# EAGLE design rpcm_board (EAGLE 8.4.2)

## Sheet 1 of 2
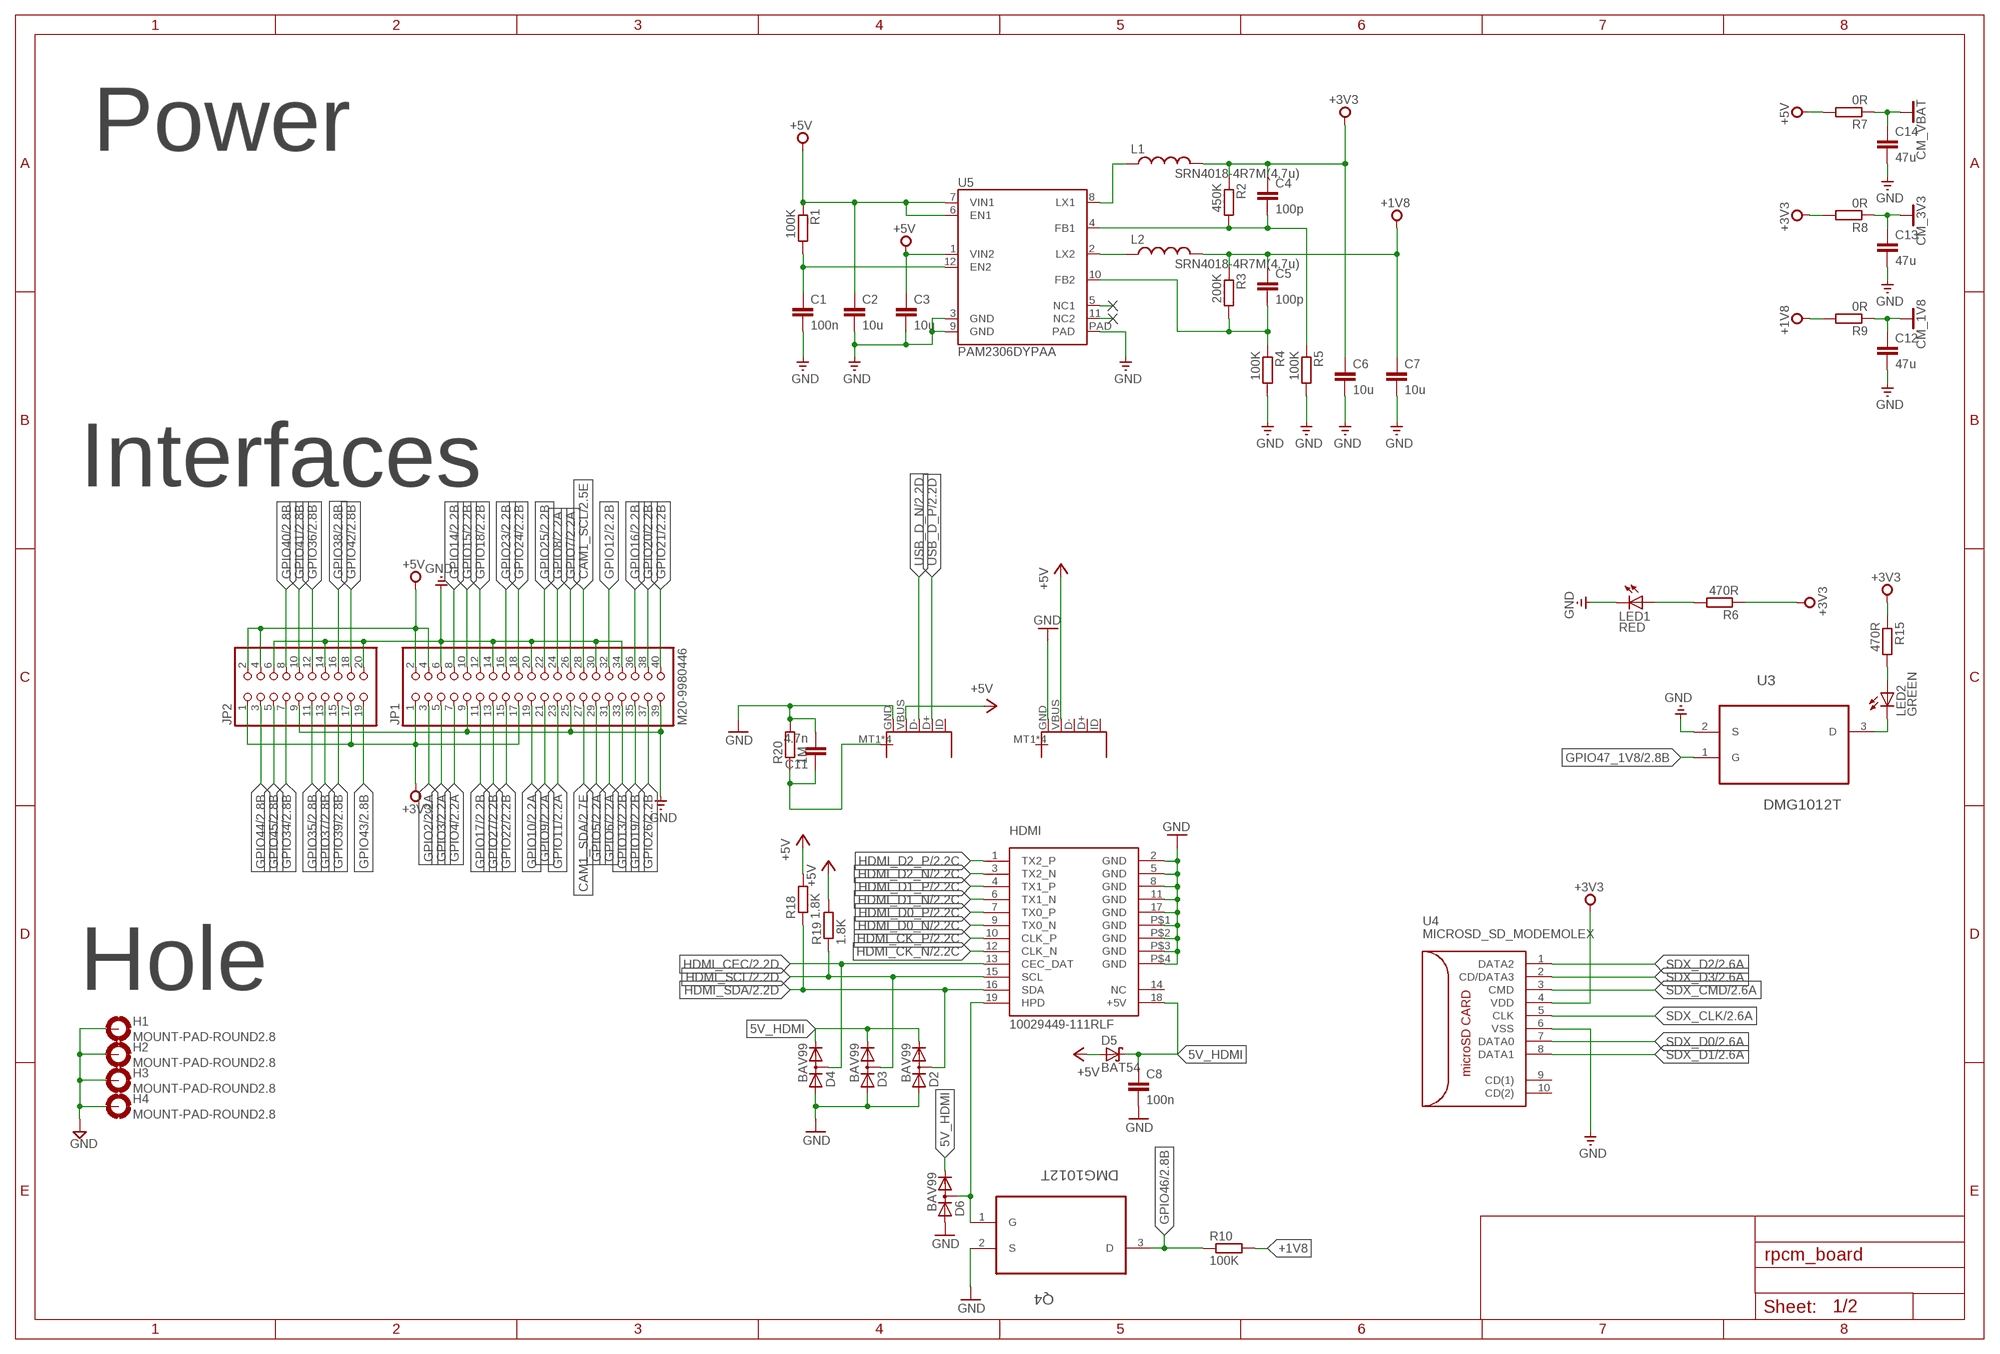
[diagram p0: schematic, sheet 1]

### Parts
C1  100n  C-EUC0402  [C0402]
C2  10u  C-EUC0805  [C0805]
C3  10u  C-EUC0805  [C0805]
C4  100p  C-EUC0402  [C0402]
C5  100p  C-EUC0402  [C0402]
C6  10u  C-EUC0805  [C0805]
C7  10u  C-EUC0805  [C0805]
C8  100n  C-EUC0402  [C0402]
C11  4.7n  C-EUC0402  [C0402]
C12  47u  C-EUC1206  [C1206]
C13  47u  C-EUC1206  [C1206]
C14  47u  C-EUC1206  [C1206]
D2  BAV99  BAV199  [SOT23]
D3  BAV99  BAV199  [SOT23]
D4  BAV99  BAV199  [SOT23]
D5  BAT54  [SOT23]
D6  BAV99  BAV199  [SOT23]
H1  MOUNT-PAD-ROUND2.8  [2,8-PAD]
H2  MOUNT-PAD-ROUND2.8  [2,8-PAD]
H3  MOUNT-PAD-ROUND2.8  [2,8-PAD]
H4  MOUNT-PAD-ROUND2.8  [2,8-PAD]
HDMI  10029449-111RLF  HDMI  [HDMI]
JP1  M20-9980446  PINHD-2X20  [2X20]
JP2  PINHD-2X10  [2X10]
JP3  USB-IDMICRO  [USB-MICRO]
JP6  USB-IDMICRO  [USB-MICRO]
L1  SRN4018-4R7M(4.7u)  BOURNS-SRN4018  [BOURNS-SRN4018]
L2  SRN4018-4R7M(4.7u)  BOURNS-SRN4018  [BOURNS-SRN4018]
LED1  RED  LEDCHIP-LED0603  [CHIP-LED0603]
LED2  GREEN  LEDCHIP-LED0603  [CHIP-LED0603]
Q4  DMG1012T  [SOT523]
R1  100K  R-EU_R0402  [R0402]
R2  450K  R-EU_R0402  [R0402]
R3  200K  R-EU_R0402  [R0402]
R4  100K  R-EU_R0402  [R0402]
R5  100K  R-EU_R0402  [R0402]
R6  470R  R-EU_R0402  [R0402]
R7  0R  R-EU_R0805  [R0805]
R8  0R  R-EU_R0805  [R0805]
R9  0R  R-EU_R0805  [R0805]
R10  100K  R-EU_R0402  [R0402]
R15  470R  R-EU_R0402  [R0402]
R18  1.8K  R-EU_R0402  [R0402]
R19  1.8K  R-EU_R0402  [R0402]
R20  1M  R-EU_R0402  [R0402]
U3  DMG1012T  [SOT523]
U4  MICROSD_SD_MODEMOLEX  [MOLEX_1040310811]
U5  PAM2306DYPAA  PAM2306  [WDFN3X3-12L]

### Nets
5V_HDMI: C8.1 D2.2(C) D3.2(C) D4.2(C) D5.3(C) D6.2(C) HDMI.18(+5V)
+1V8: C5.1 C7.1 L2.P$1 R3.1 R9.2 R10.2
+3V3: C4.1 C6.1 JP1.1 JP1.17 JP2.1 JP2.17 L1.P$1 R2.1 R6.1 R8.2 R15.1 U4.4(VDD) ; also sheet 2
+5V [VCC]: C2.1 C3.1 D5.1(A) JP1.2 JP1.4 JP2.2 JP2.4 JP3.VBUS JP6.VBUS R1.1 R7.2 R18.2 R19.2 U5.1(VIN2) U5.6(EN1) U5.7(VIN1)
CAM1_SCL: JP1.28 ; also sheet 2
CAM1_SDA: JP1.27 ; also sheet 2
CM_1V8: C12.1 R9.1 ; also sheet 2
CM_3V3: C13.1 R8.1 ; also sheet 2
CM_VBAT: C14.1 R7.1 ; also sheet 2
GND [GND]: C1.2 C2.2 C3.2 C6.2 C7.2 C8.2 C11.2 C12.2 C13.2 C14.2 D2.1(A) D3.1(A) D4.1(A) D6.1(A) H1.B2,8(MOUNT) H2.B2,8(MOUNT) H3.B2,8(MOUNT) H4.B2,8(MOUNT) HDMI.2(GND) HDMI.5(GND) HDMI.8(GND) HDMI.11(GND) HDMI.17(GND) HDMI.P$1(GND) HDMI.P$2(GND) HDMI.P$3(GND) HDMI.P$4(GND) JP1.6 JP1.9 JP1.14 JP1.20 JP1.25 JP1.30 JP1.34 JP1.39 JP2.6 JP2.9 JP2.14 JP2.20 JP3.GND JP6.GND LED1.C Q4.2(S) R4.2 R5.2 R20.2 U3.2(S) U4.6(VSS) U5.3(GND) U5.9(GND) U5.PAD ; also sheet 2
GPIO2: JP1.3 ; also sheet 2
GPIO3: JP1.5 ; also sheet 2
GPIO4: JP1.7 ; also sheet 2
GPIO5: JP1.29 ; also sheet 2
GPIO6: JP1.31 ; also sheet 2
GPIO7: JP1.26 ; also sheet 2
GPIO8: JP1.24 ; also sheet 2
GPIO9: JP1.21 ; also sheet 2
GPIO10: JP1.19 ; also sheet 2
GPIO11: JP1.23 ; also sheet 2
GPIO12: JP1.32 ; also sheet 2
GPIO13: JP1.33 ; also sheet 2
GPIO14: JP1.8 ; also sheet 2
GPIO15: JP1.10 ; also sheet 2
GPIO16: JP1.36 ; also sheet 2
GPIO17: JP1.11 ; also sheet 2
GPIO18: JP1.12 ; also sheet 2
GPIO19: JP1.35 ; also sheet 2
GPIO20: JP1.38 ; also sheet 2
GPIO21: JP1.40 ; also sheet 2
GPIO22: JP1.15 ; also sheet 2
GPIO23: JP1.16 ; also sheet 2
GPIO24: JP1.18 ; also sheet 2
GPIO25: JP1.22 ; also sheet 2
GPIO26: JP1.37 ; also sheet 2
GPIO27: JP1.13 ; also sheet 2
GPIO34: JP2.7 ; also sheet 2
GPIO35: JP2.11 ; also sheet 2
GPIO36: JP2.12 ; also sheet 2
GPIO37: JP2.13 ; also sheet 2
GPIO38: JP2.16 ; also sheet 2
GPIO39: JP2.15 ; also sheet 2
GPIO40: JP2.8 ; also sheet 2
GPIO41: JP2.10 ; also sheet 2
GPIO42: JP2.18 ; also sheet 2
GPIO43: JP2.19 ; also sheet 2
GPIO44: JP2.3 ; also sheet 2
GPIO45: JP2.5 ; also sheet 2
GPIO46: Q4.3(D) R10.1 ; also sheet 2
GPIO47_1V8: U3.1(G) ; also sheet 2
HDMI_CEC: D4.3(AC) HDMI.13(CEC_DAT) ; also sheet 2
HDMI_CK_N: HDMI.12(CLK_N) ; also sheet 2
HDMI_CK_P: HDMI.10(CLK_P) ; also sheet 2
HDMI_D0_N: HDMI.9(TX0_N) ; also sheet 2
HDMI_D0_P: HDMI.7(TX0_P) ; also sheet 2
HDMI_D1_N: HDMI.6(TX1_N) ; also sheet 2
HDMI_D1_P: HDMI.4(TX1_P) ; also sheet 2
HDMI_D2_N: HDMI.3(TX2_N) ; also sheet 2
HDMI_D2_P: HDMI.1(TX2_P) ; also sheet 2
HDMI_SCL: D3.3(AC) HDMI.15(SCL) R19.1 ; also sheet 2
HDMI_SDA: D2.3(AC) HDMI.16(SDA) R18.1 ; also sheet 2
N$1: C1.1 R1.2 U5.12(EN2)
N$2: L1.P$2 U5.8(LX1)
N$3: U5.5(NC1)
N$4: U5.11(NC2)
N$7: L2.P$2 U5.2(LX2)
N$8: C4.2 R2.2 R5.1 U5.4(FB1)
N$9: LED1.A R6.2
N$10: C5.2 R3.2 R4.1 U5.10(FB2)
N$32: LED2.A R15.2
N$33: LED2.C U3.3(D)
N$34: D6.3(AC) HDMI.19(HPD) Q4.1(G)
SDX_CLK: U4.5(CLK) ; also sheet 2
SDX_CMD: U4.3(CMD) ; also sheet 2
SDX_D0: U4.7(DATA0) ; also sheet 2
SDX_D1: U4.8(DATA1) ; also sheet 2
SDX_D2: U4.1(DATA2) ; also sheet 2
SDX_D3: U4.2(CD/DATA3) ; also sheet 2
USB2_SHELL [GND]: C11.1 JP6.MT1(SHELL) JP6.MT2(SHELL) JP6.P$1(SHELL) JP6.P$2(SHELL) R20.1
USB_D_N [90ohm_differencial_pair]: JP6.D- ; also sheet 2
USB_D_P [90ohm_differencial_pair]: JP6.D+ ; also sheet 2
Unconnected: HDMI.14(NC) JP3.D+ JP3.D- JP3.ID JP3.MT1(SHELL) JP3.MT2(SHELL) JP3.P$1(SHELL) JP3.P$2(SHELL) JP6.ID U4.9(CD(1)) U4.10(CD(2))

### Notes on the sheet
- Power
- Interfaces
- Hole

## Sheet 2 of 2
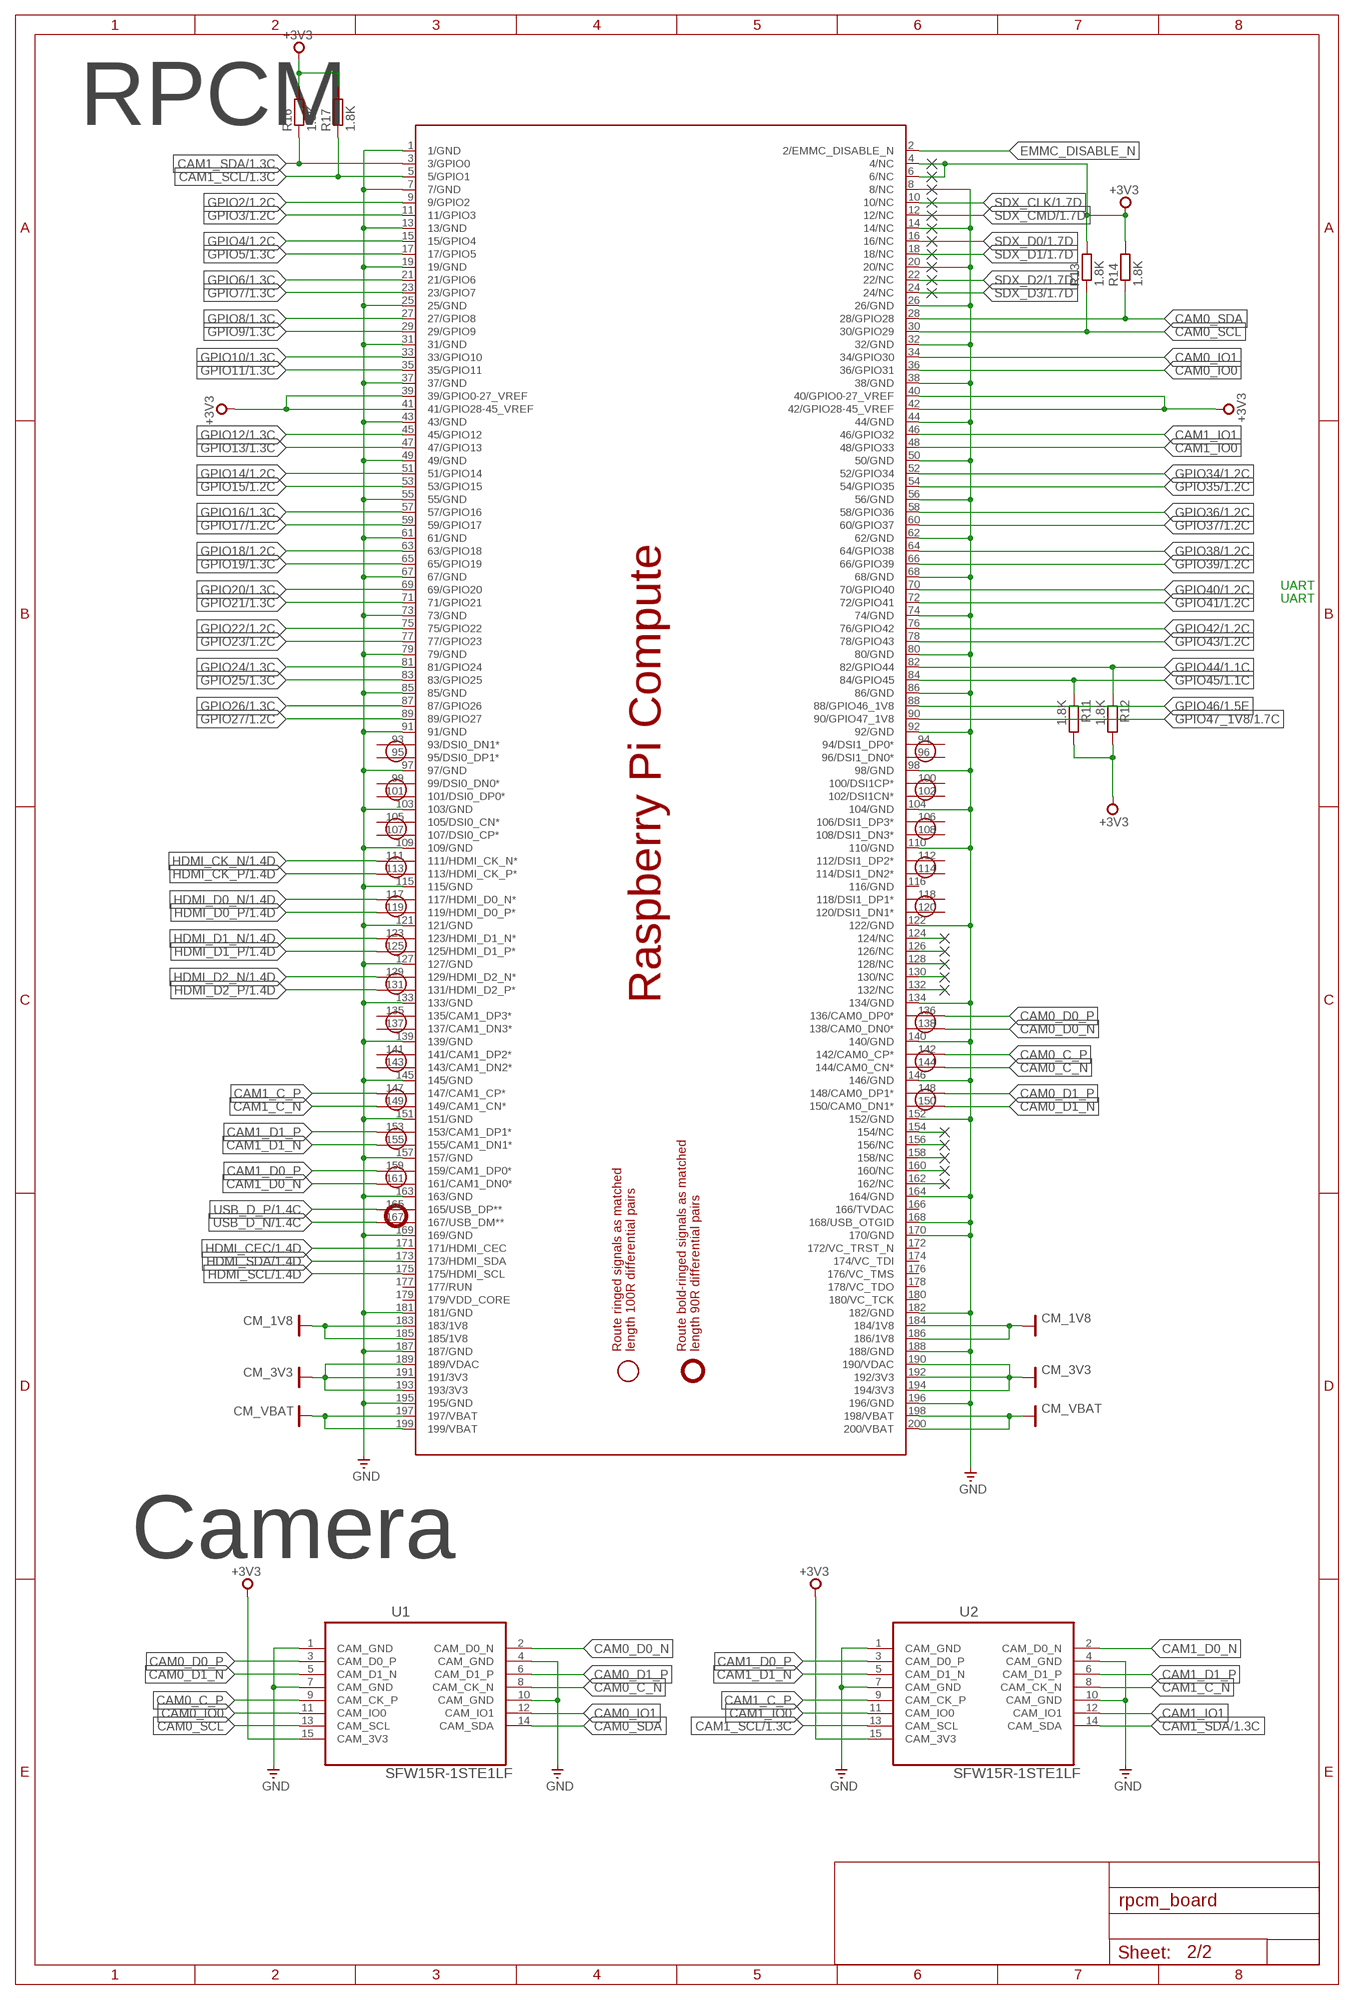
[diagram p1: schematic, sheet 2]

### Parts
PCB1  1473005-4  RPI_COMPUTE  [RPI_COMPUTE]
R11  1.8K  R-EU_R0402  [R0402]
R12  1.8K  R-EU_R0402  [R0402]
R13  1.8K  R-EU_R0402  [R0402]
R14  1.8K  R-EU_R0402  [R0402]
R16  1.8K  R-EU_R0402  [R0402]
R17  1.8K  R-EU_R0402  [R0402]
U1  SFW15R-1STE1LF  RPI_CAMERA  [RPI_CAMERA]
U2  SFW15R-1STE1LF  RPI_CAMERA  [RPI_CAMERA]

### Nets
+3V3: PCB1.4(4/NC) PCB1.6(6/NC) PCB1.39(39/GPIO0-27_VREF) PCB1.40(40/GPIO0-27_VREF) PCB1.41(41/GPIO28-45_VREF) PCB1.42(42/GPIO28-45_VREF) R11.2 R12.2 R13.2 R14.2 R16.2 R17.2 U1.15(CAM_3V3) U2.15(CAM_3V3) ; also sheet 1
CAM0_C_N [100ohm_differencial_pair]: PCB1.144(144/CAM0_CN*) U1.8(CAM_CK_N)
CAM0_C_P [100ohm_differencial_pair]: PCB1.142(142/CAM0_CP*) U1.9(CAM_CK_P)
CAM0_D0_N [100ohm_differencial_pair]: PCB1.138(138/CAM0_DN0*) U1.2(CAM_D0_N)
CAM0_D0_P [100ohm_differencial_pair]: PCB1.136(136/CAM0_DP0*) U1.3(CAM_D0_P)
CAM0_D1_N [100ohm_differencial_pair]: PCB1.150(150/CAM0_DN1*) U1.5(CAM_D1_N)
CAM0_D1_P [100ohm_differencial_pair]: PCB1.148(148/CAM0_DP1*) U1.6(CAM_D1_P)
CAM0_IO0: PCB1.36(36/GPIO31) U1.11(CAM_IO0)
CAM0_IO1: PCB1.34(34/GPIO30) U1.12(CAM_IO1)
CAM0_SCL: PCB1.30(30/GPIO29) R13.1 U1.13(CAM_SCL)
CAM0_SDA: PCB1.28(28/GPIO28) R14.1 U1.14(CAM_SDA)
CAM1_C_N [100ohm_differencial_pair]: PCB1.149(149/CAM1_CN*) U2.8(CAM_CK_N)
CAM1_C_P [100ohm_differencial_pair]: PCB1.147(147/CAM1_CP*) U2.9(CAM_CK_P)
CAM1_D0_N [100ohm_differencial_pair]: PCB1.161(161/CAM1_DN0*) U2.2(CAM_D0_N)
CAM1_D0_P [100ohm_differencial_pair]: PCB1.159(159/CAM1_DP0*) U2.3(CAM_D0_P)
CAM1_D1_N [100ohm_differencial_pair]: PCB1.155(155/CAM1_DN1*) U2.5(CAM_D1_N)
CAM1_D1_P [100ohm_differencial_pair]: PCB1.153(153/CAM1_DP1*) U2.6(CAM_D1_P)
CAM1_IO0: PCB1.48(48/GPIO33) U2.11(CAM_IO0)
CAM1_IO1: PCB1.46(46/GPIO32) U2.12(CAM_IO1)
CAM1_SCL: PCB1.5(5/GPIO1) R17.1 U2.13(CAM_SCL) ; also sheet 1
CAM1_SDA: PCB1.3(3/GPIO0) R16.1 U2.14(CAM_SDA) ; also sheet 1
CM_1V8: PCB1.183(183/1V8) PCB1.184(184/1V8) PCB1.185(185/1V8) PCB1.186(186/1V8) ; also sheet 1
CM_3V3: PCB1.189(189/VDAC) PCB1.190(190/VDAC) PCB1.191(191/3V3) PCB1.192(192/3V3) PCB1.193(193/3V3) PCB1.194(194/3V3) ; also sheet 1
CM_VBAT: PCB1.197(197/VBAT) PCB1.198(198/VBAT) PCB1.199(199/VBAT) PCB1.200(200/VBAT) ; also sheet 1
EMMC_DISABLE_N: PCB1.2(2/EMMC_DISABLE_N)
GND [GND]: PCB1.1(1/GND) PCB1.7(7/GND) PCB1.8(8/NC) PCB1.13(13/GND) PCB1.14(14/NC) PCB1.19(19/GND) PCB1.20(20/NC) PCB1.25(25/GND) PCB1.26(26/GND) PCB1.31(31/GND) PCB1.32(32/GND) PCB1.37(37/GND) PCB1.38(38/GND) PCB1.43(43/GND) PCB1.44(44/GND) PCB1.49(49/GND) PCB1.50(50/GND) PCB1.55(55/GND) PCB1.56(56/GND) PCB1.61(61/GND) PCB1.62(62/GND) PCB1.67(67/GND) PCB1.68(68/GND) PCB1.73(73/GND) PCB1.74(74/GND) PCB1.79(79/GND) PCB1.80(80/GND) PCB1.85(85/GND) PCB1.86(86/GND) PCB1.91(91/GND) PCB1.92(92/GND) PCB1.97(97/GND) PCB1.98(98/GND) PCB1.103(103/GND) PCB1.104(104/GND) PCB1.109(109/GND) PCB1.110(110/GND) PCB1.115(115/GND) PCB1.121(121/GND) PCB1.122(122/GND) PCB1.127(127/GND) PCB1.133(133/GND) PCB1.134(134/GND) PCB1.139(139/GND) PCB1.140(140/GND) PCB1.145(145/GND) PCB1.146(146/GND) PCB1.151(151/GND) PCB1.152(152/GND) PCB1.157(157/GND) PCB1.163(163/GND) PCB1.164(164/GND) PCB1.168(168/USB_OTGID) PCB1.169(169/GND) PCB1.170(170/GND) PCB1.181(181/GND) PCB1.182(182/GND) PCB1.187(187/GND) PCB1.188(188/GND) PCB1.195(195/GND) PCB1.196(196/GND) U1.1(CAM_GND) U1.4(CAM_GND) U1.7(CAM_GND) U1.10(CAM_GND) U2.1(CAM_GND) U2.4(CAM_GND) U2.7(CAM_GND) U2.10(CAM_GND) ; also sheet 1
GPIO2: PCB1.9(9/GPIO2) ; also sheet 1
GPIO3: PCB1.11(11/GPIO3) ; also sheet 1
GPIO4: PCB1.15(15/GPIO4) ; also sheet 1
GPIO5: PCB1.17(17/GPIO5) ; also sheet 1
GPIO6: PCB1.21(21/GPIO6) ; also sheet 1
GPIO7: PCB1.23(23/GPIO7) ; also sheet 1
GPIO8: PCB1.27(27/GPIO8) ; also sheet 1
GPIO9: PCB1.29(29/GPIO9) ; also sheet 1
GPIO10: PCB1.33(33/GPIO10) ; also sheet 1
GPIO11: PCB1.35(35/GPIO11) ; also sheet 1
GPIO12: PCB1.45(45/GPIO12) ; also sheet 1
GPIO13: PCB1.47(47/GPIO13) ; also sheet 1
GPIO14: PCB1.51(51/GPIO14) ; also sheet 1
GPIO15: PCB1.53(53/GPIO15) ; also sheet 1
GPIO16: PCB1.57(57/GPIO16) ; also sheet 1
GPIO17: PCB1.59(59/GPIO17) ; also sheet 1
GPIO18: PCB1.63(63/GPIO18) ; also sheet 1
GPIO19: PCB1.65(65/GPIO19) ; also sheet 1
GPIO20: PCB1.69(69/GPIO20) ; also sheet 1
GPIO21: PCB1.71(71/GPIO21) ; also sheet 1
GPIO22: PCB1.75(75/GPIO22) ; also sheet 1
GPIO23: PCB1.77(77/GPIO23) ; also sheet 1
GPIO24: PCB1.81(81/GPIO24) ; also sheet 1
GPIO25: PCB1.83(83/GPIO25) ; also sheet 1
GPIO26: PCB1.87(87/GPIO26) ; also sheet 1
GPIO27: PCB1.89(89/GPIO27) ; also sheet 1
GPIO34: PCB1.52(52/GPIO34) ; also sheet 1
GPIO35: PCB1.54(54/GPIO35) ; also sheet 1
GPIO36: PCB1.58(58/GPIO36) ; also sheet 1
GPIO37: PCB1.60(60/GPIO37) ; also sheet 1
GPIO38: PCB1.64(64/GPIO38) ; also sheet 1
GPIO39: PCB1.66(66/GPIO39) ; also sheet 1
GPIO40: PCB1.70(70/GPIO40) ; also sheet 1
GPIO41: PCB1.72(72/GPIO41) ; also sheet 1
GPIO42: PCB1.76(76/GPIO42) ; also sheet 1
GPIO43: PCB1.78(78/GPIO43) ; also sheet 1
GPIO44: PCB1.82(82/GPIO44) R12.1 ; also sheet 1
GPIO45: PCB1.84(84/GPIO45) R11.1 ; also sheet 1
GPIO46: PCB1.88(88/GPIO46_1V8) ; also sheet 1
GPIO47_1V8: PCB1.90(90/GPIO47_1V8) ; also sheet 1
HDMI_CEC: PCB1.171(171/HDMI_CEC) ; also sheet 1
HDMI_CK_N: PCB1.111(111/HDMI_CK_N*) ; also sheet 1
HDMI_CK_P: PCB1.113(113/HDMI_CK_P*) ; also sheet 1
HDMI_D0_N: PCB1.117(117/HDMI_D0_N*) ; also sheet 1
HDMI_D0_P: PCB1.119(119/HDMI_D0_P*) ; also sheet 1
HDMI_D1_N: PCB1.123(123/HDMI_D1_N*) ; also sheet 1
HDMI_D1_P: PCB1.125(125/HDMI_D1_P*) ; also sheet 1
HDMI_D2_N: PCB1.129(129/HDMI_D2_N*) ; also sheet 1
HDMI_D2_P: PCB1.131(131/HDMI_D2_P*) ; also sheet 1
HDMI_SCL: PCB1.175(175/HDMI_SCL) ; also sheet 1
HDMI_SDA: PCB1.173(173/HDMI_SDA) ; also sheet 1
N$11: PCB1.154(154/NC)
N$12: PCB1.156(156/NC)
N$13: PCB1.158(158/NC)
N$14: PCB1.160(160/NC)
N$15: PCB1.162(162/NC)
N$24: PCB1.124(124/NC)
N$25: PCB1.126(126/NC)
N$26: PCB1.128(128/NC)
N$27: PCB1.130(130/NC)
N$28: PCB1.132(132/NC)
SDX_CLK: PCB1.10(10/NC) ; also sheet 1
SDX_CMD: PCB1.12(12/NC) ; also sheet 1
SDX_D0: PCB1.16(16/NC) ; also sheet 1
SDX_D1: PCB1.18(18/NC) ; also sheet 1
SDX_D2: PCB1.22(22/NC) ; also sheet 1
SDX_D3: PCB1.24(24/NC) ; also sheet 1
USB_D_N [90ohm_differencial_pair]: PCB1.167(167/USB_DM**) ; also sheet 1
USB_D_P [90ohm_differencial_pair]: PCB1.165(165/USB_DP**) ; also sheet 1
Unconnected: PCB1.93(93/DSI0_DN1*) PCB1.94(94/DSI1_DP0*) PCB1.95(95/DSI0_DP1*) PCB1.96(96/DSI1_DN0*) PCB1.99(99/DSI0_DN0*) PCB1.100(100/DSI1CP*) PCB1.101(101/DSI0_DP0*) PCB1.102(102/DSI1CN*) PCB1.105(105/DSI0_CN*) PCB1.106(106/DSI1_DP3*) PCB1.107(107/DSI0_CP*) PCB1.108(108/DSI1_DN3*) PCB1.112(112/DSI1_DP2*) PCB1.114(114/DSI1_DN2*) PCB1.116(116/GND) PCB1.118(118/DSI1_DP1*) PCB1.120(120/DSI1_DN1*) PCB1.135(135/CAM1_DP3*) PCB1.137(137/CAM1_DN3*) PCB1.141(141/CAM1_DP2*) PCB1.143(143/CAM1_DN2*) PCB1.166(166/TVDAC) PCB1.172(172/VC_TRST_N) PCB1.174(174/VC_TDI) PCB1.176(176/VC_TMS) PCB1.177(177/RUN) PCB1.178(178/VC_TDO) PCB1.179(179/VDD_CORE) PCB1.180(180/VC_TCK)

### Notes on the sheet
- RPCM
- UART
- UART
- Camera

## Library data of the parts
C1-C8 C11-C14 = resistor:C-EU: CAPACITOR, European symbol
D2-D4 D6 = diode:BAV199: DIODE low-leakage double diode
D5 = diode:BAT54: Schottky Diodes Source: Fairchild .. BAT54.pdf
H1-H4 = holes:MOUNT-PAD-ROUND: MOUNTING PAD, round
HDMI = raspi:HDMI
JP1 = pinhead:PINHD-2X20: PIN HEADER
JP2 = pinhead+:PINHD-2X10: PIN HEADER
JP3 JP6 = openblw:USB-ID; PROD_ID: CONN-09505
L1 L2 = openblw:BOURNS-SRN4018
LED1 LED2 = led:LED: LED OSRAM: - CHIPLED LG R971, LG N971, LY N971, LG Q971, LY Q971, LO R971, LY R971 LH N974, LH R974 LS Q976, LO Q976, LY Q976 LO Q996 - Hyper CHIPLED LW Q18S LB Q993, LB Q99A, LB R99A - SideLED LS A670, LO A670, LY A670, LG A670, LP A670 LB A673, LV A673, LT A673, LW A673 LH A674 LY A675 LS A676, LA A676, LO A676, LY A676, LW A676 LS A679, LY A679, LG A679 - Hyper Micro SIDELED® LS Y876, LA Y876, LO Y876, LY Y876 LT Y87S - SmartLED LW L88C, LW L88S LB L89C, LB L89S, LG L890 LS L89K, LO L89K, LY L89K LS L896, LA L896, LO L896, LY L896 - TOPLED LS T670, LO T670, LY T670, LG T670, LP T670 LSG T670, LSP T670, LSY T670, LOP T670, LYG T670 LG T671, LOG T671, LSG T671 LB T673, LV T673, LT T673, LW T673 LH T674 LS T676, LA T676, LO T676, LY T676, LB T676, LH T676, LSB T676, LW T676 LB T67C, LV T67C, LT T67C, LS T67K, LO T67K, LY T67K, LW E67C LS E67B, LA E67B, LO E67B, LY E67B, LB E67C, LV E67C, LT E67C LW T67C LS T679, LY T679, LG T679 LS T770, LO T770, LY T770, LG T770, LP T770 LB T773, LV T773, LT T773, LW T773 LH T774 LS E675, LA E675, LY E675, LS T675 LS T776, LA T776, LO T776, LY T776, LB T776 LHGB T686 LT T68C, LB T68C - Hyper Mini TOPLED® LB M676 - Mini TOPLED Santana® LG M470 LS M47K, LO M47K, LY M47K Source: http://www.osram.convergy.de LUXEON: - LUMILED® LXK2-PW12-R00, LXK2-PW12-S00, LXK2-PW14-U00, LXK2-PW14-V00 LXK2-PM12-R00, LXK2-PM12-S00, LXK2-PM14-U00 LXK2-PE12-Q00, LXK2-PE12-R00, LXK2-PE12-S00, LXK2-PE14-T00, LXK2-PE14-U00 LXK2-PB12-K00, LXK2-PB12-L00, LXK2-PB12-M00, LXK2-PB14-N00, LXK2-PB14-P00, LXK2-PB14-Q00 LXK2-PR12-L00, LXK2-PR12-M00, LXK2-PR14-Q00, LXK2-PR14-R00 LXK2-PD12-Q00, LXK2-PD12-R00, LXK2-PD12-S00 LXK2-PH12-R00, LXK2-PH12-S00 LXK2-PL12-P00, LXK2-PL12-Q00, LXK2-PL12-R00 Source: www.luxeon.com KINGBRIGHT: KA-3528ASYC Source: www.kingbright.com
PCB1 = openblw:RPI_COMPUTE: Device for a Raspberry PI Compute module. Note that the package is for a DDR2 connector of 'standard' orientation. Example: TE Connectivity P/N: 1565917-4, Newark P/N: 08P0616, Farnell P/N: 2112525 More information is available at http://www.element14.com/community/community/raspberry-pi/raspberry-pi-compute-module
Q4 U3 = openblw:DMG1012T
R1-R20 = resistor:R-EU_: RESISTOR, European symbol
U1 U2 = openblw:RPI_CAMERA: FFC/FPC CONNECTOR, RECEPTACLE 16POS 1ROW; MPN: SFW16R-1STE1LF; OC_FARNELL: 1835594; OC_NEWARK: 62K5606; PACKAGE: CONNECTOR- 16POS; SUPPLIER: FCI
U4 = openblw:MICROSD_SD_MODE: MOLEX - 49225-0821 - CONNECTEUR MICRO SD PUSH/PUSH REV Fabricant: MOLEX Code commande Farnell: 1366700 <http://fr.farnell.com/molex/49225-0821/connecteur-micro-sd-push-push-rev/dp/1366700?Ntt=1366700> Référence fabricant: 49225-0821
U5 = openblw:PAM2306

## Net classes
1 GND: width 0.508 mm, drill 0.3 mm, clearance 0.2 mm to class 0, clearance 0.2 mm
2 100ohm_differencial_pair: width 0.254 mm, drill 0.3 mm, clearance 0.5 mm to class 0, clearance 0.5 mm to class 1, clearance 0.25 mm
3 90ohm_differencial_pair: width 0.254 mm, drill 0.3 mm, clearance 0.5 mm to class 0, clearance 0.5 mm to class 1, clearance 0.5 mm to class 2, clearance 0.15 mm
4 AGND: width 0.508 mm, drill 0.3 mm, clearance 0.5 mm to class 0, clearance 0.5 mm to class 1, clearance 0.5 mm to class 2, clearance 0.5 mm to class 3, clearance 0.15 mm
5 VCC: width 0.508 mm, drill 0.3 mm, clearance 0.3 mm to class 0, clearance 0.3 mm to class 1, clearance 0.5 mm to class 2, clearance 0.5 mm to class 3, clearance 0.5 mm to class 4, clearance 0.3 mm

## Board
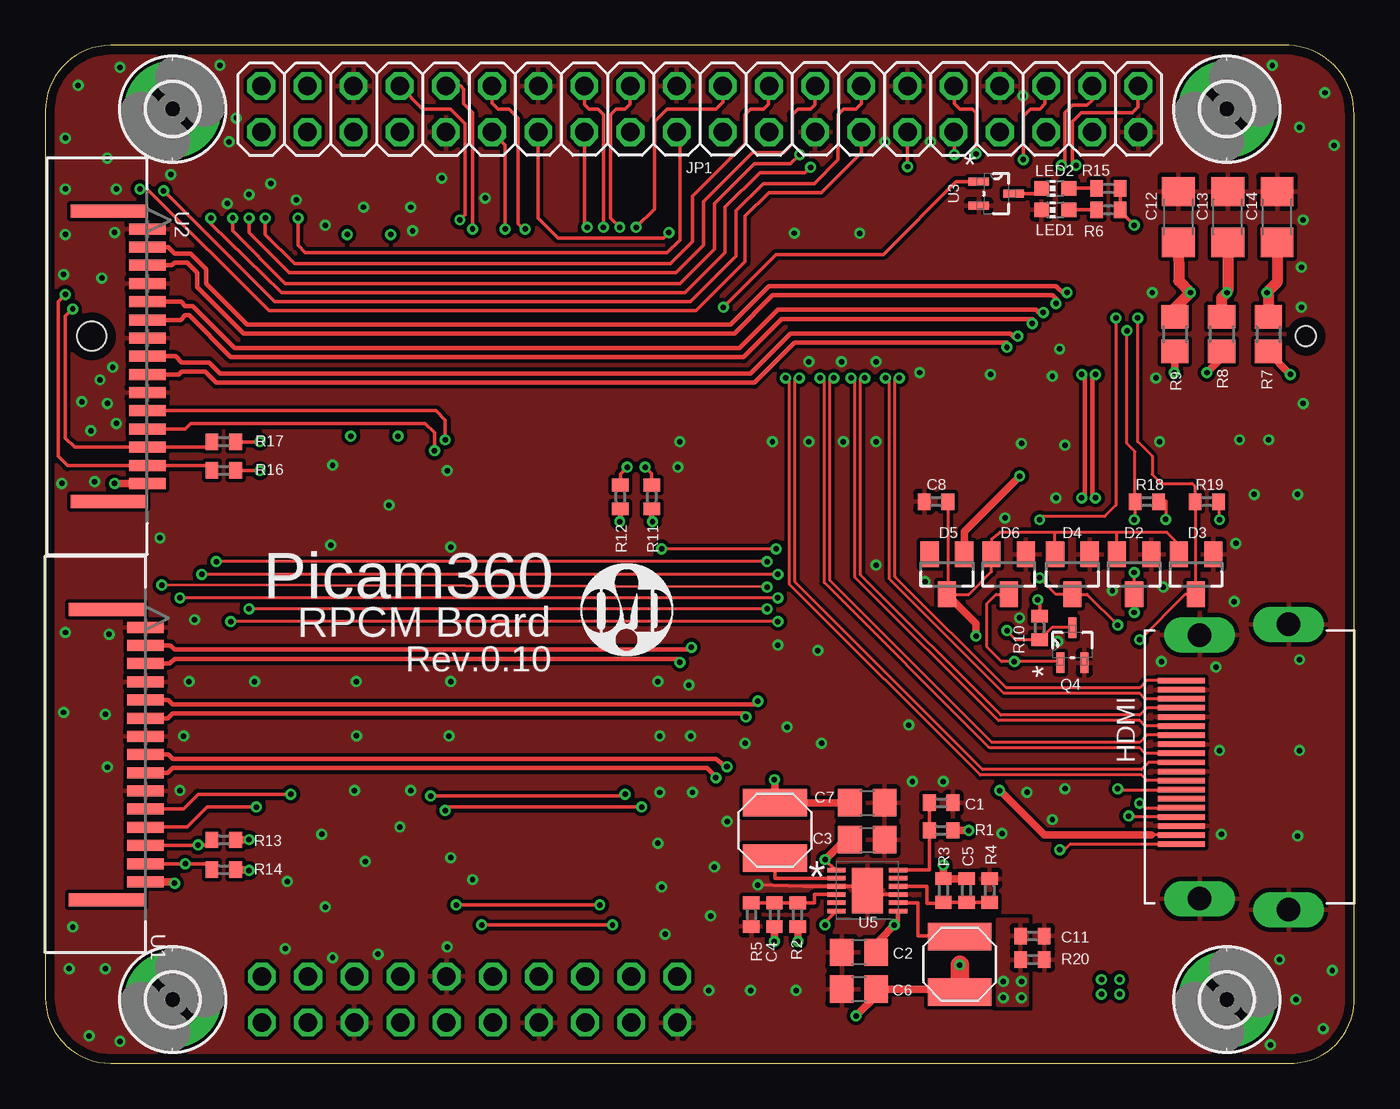
[diagram p2: board, top side]
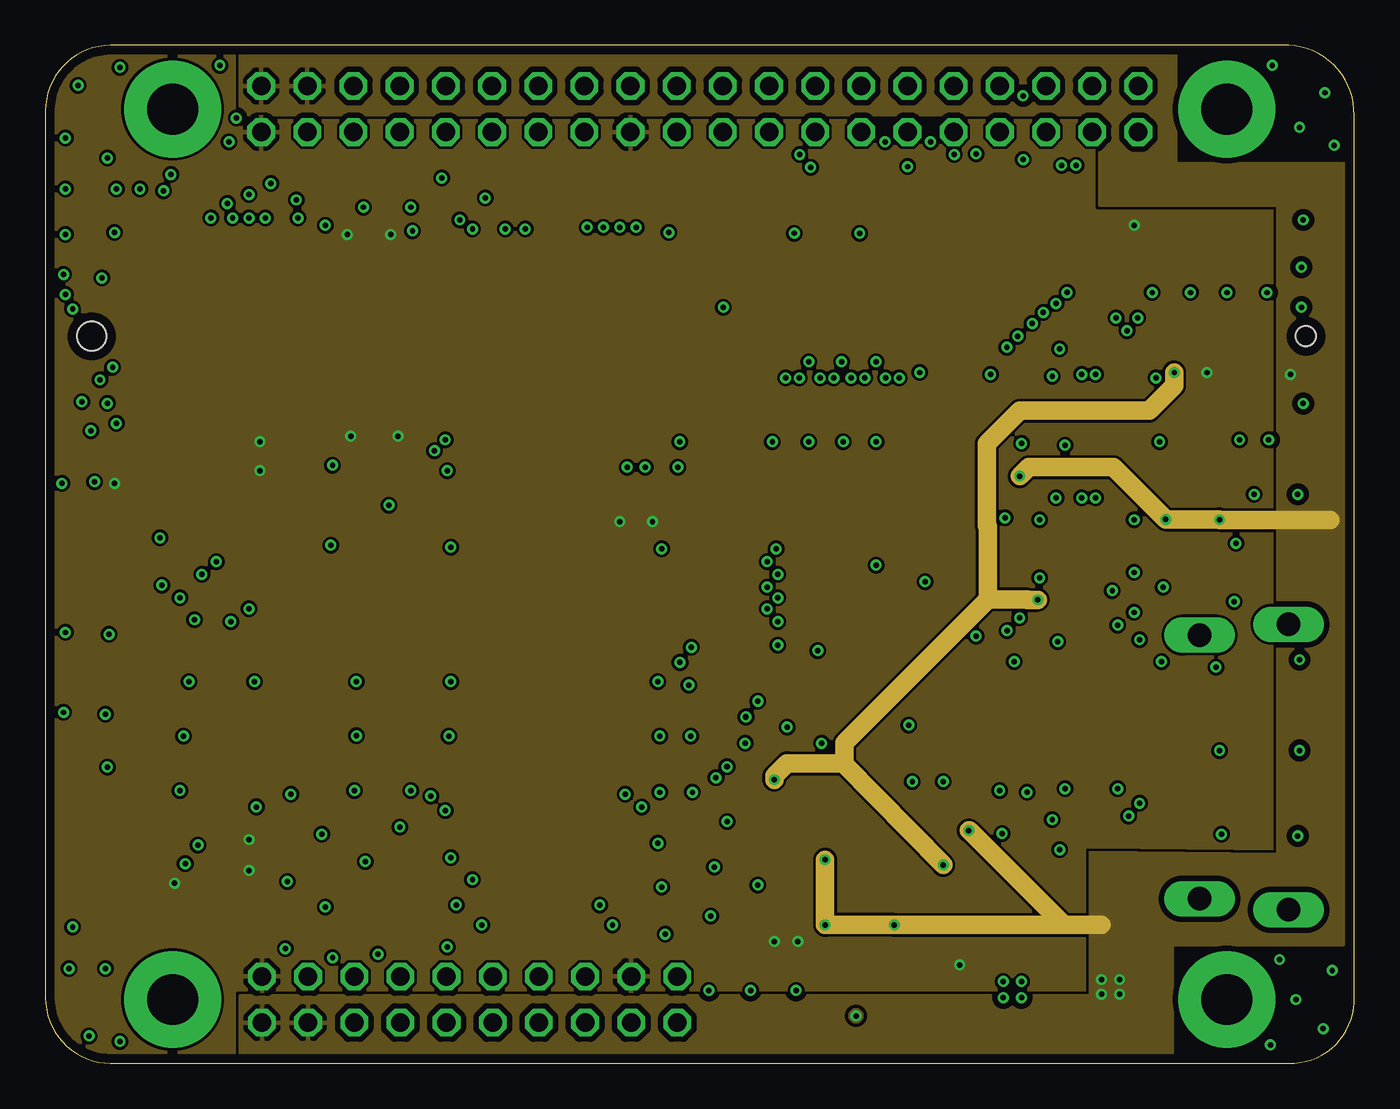
[diagram p3: board, inner layer Route2]
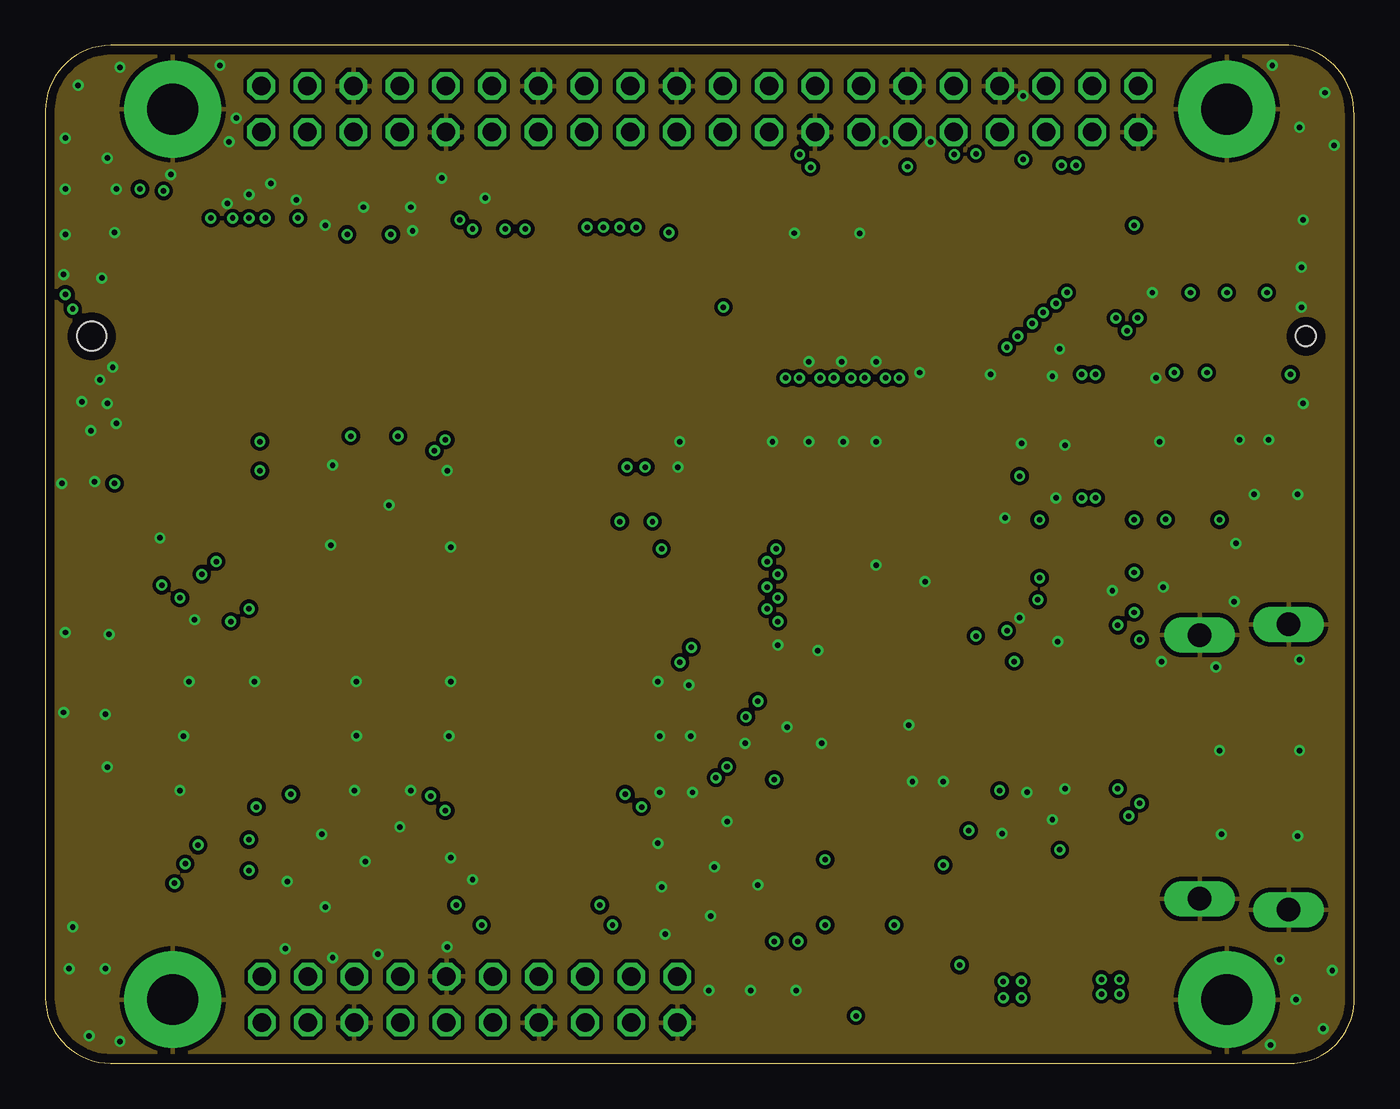
[diagram p4: board, inner layer Route15]
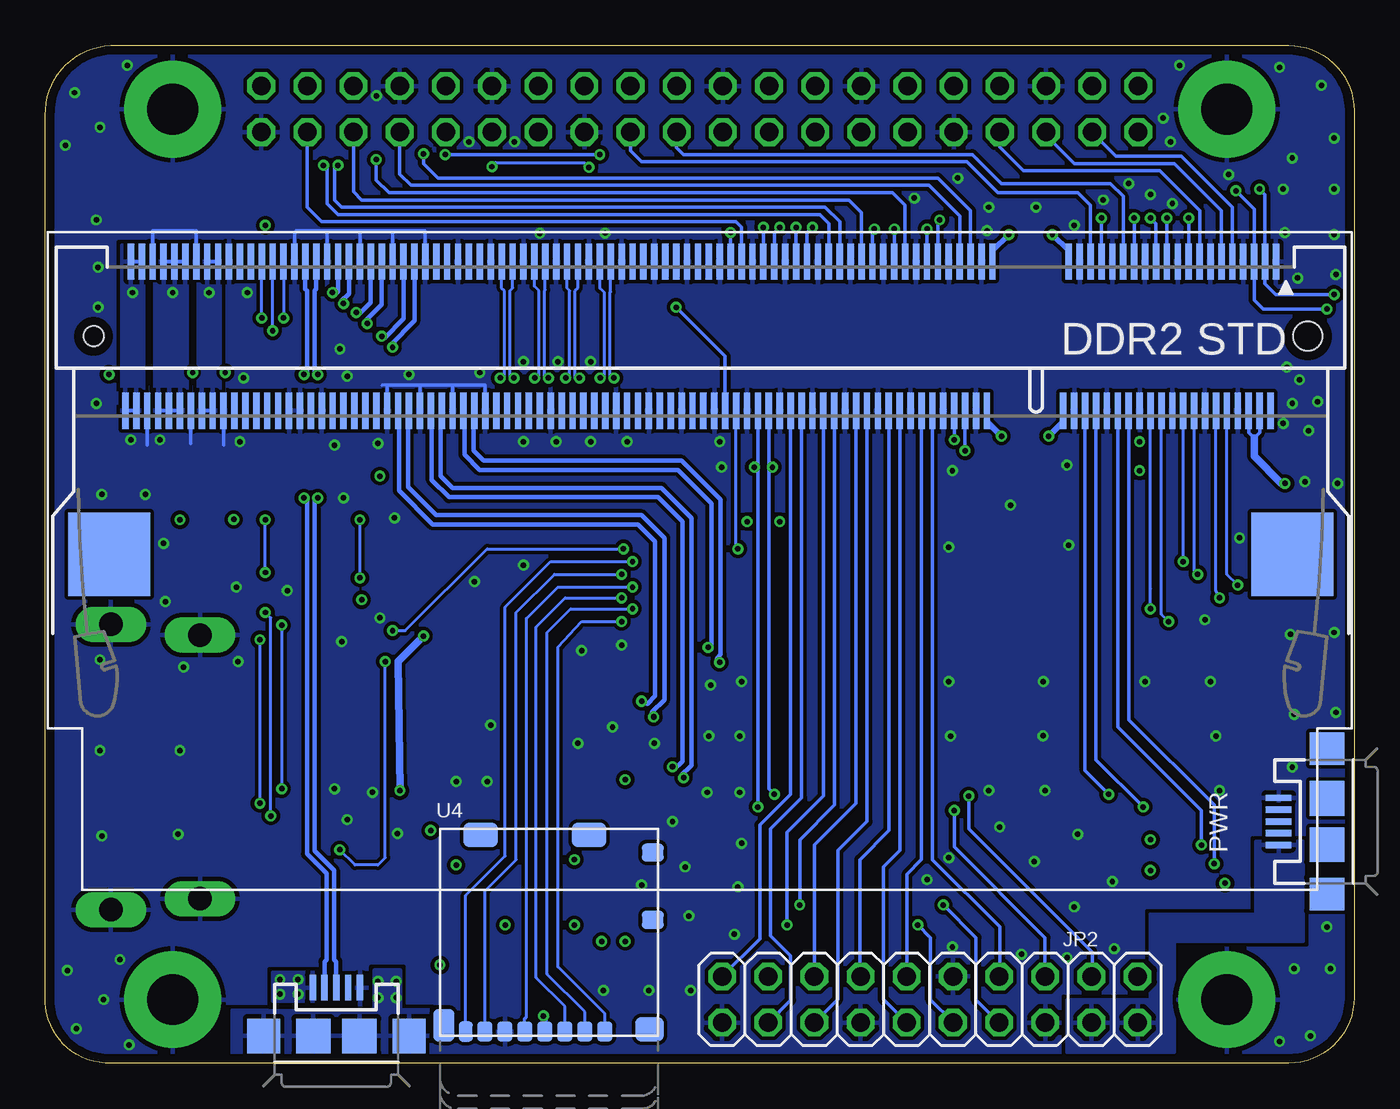
[diagram p5: board, bottom side, seen from below]

Size 72 x 56 mm. Coordinates in mm from the lower left corner, seen from the top.
Outline: 72,52.15 arc90 68.4,56 3.6,56 arc90 0,52.4 0,3.6 arc90 3.6,0 68.4,0 arc90 72,3.35 72,52.15
Copper layers (1*2*15*16): Top 0.035mm / dielectric 0.2mm / Route2 0.035mm / dielectric 1.2mm / Route15 0.035mm / dielectric 0.2mm / Bottom 0.035mm
Design rules "Elecrow_4-layer_PCB_eagle_rule *": minimum track width 6mil, minimum drill 0.3mm, track to track 6mil, track to pad 6mil, pad to pad 6mil, via to via 8mil, smd to smd 0mil, copper to edge 20mil, drill to drill 10mil, minimum pad ring 6mil, minimum via ring 6mil, stop-mask expansion 0mil, vias tented up to drill 100mil, thermal gap 10mil

### Footprints (pad centres in the part's own frame; a part is rotated, then mirrored left to right if it is on the bottom)
C0402 = smd 0.7 x 0.9: 1 -0.65,0; 2 0.65,0
C0805 = smd 1.3 x 1.5: 1 -0.95,0; 2 0.95,0
C1206 = smd 1.6 x 1.8: 1 -1.4,0; 2 1.4,0
SOT23 = smd 1 x 1.4: 1 -0.95,-1.1; 2 0.95,-1.1; 3 0,1.1
2,8-PAD = drill 2.8 pad 5.334: B2,8 0,0
HDMI = smd 0.3 x 2.6: 1 4.75,4; 2 4.25,4; 3 3.75,4; 4 3.25,4; 5 2.75,4; 6 2.25,4; 7 1.75,4; 8 1.25,4; 9 0.75,4; 10 0.25,4; 11 -0.25,4; 12 -0.75,4; 13 -1.25,4; 14 -1.75,4; 15 -2.25,4; 16 -2.75,4; 17 -3.25,4; 18 -3.75,4; 19 -4.25,4 | drill 1.3 long: P$1 7.25,3; P$2 -7.25,3; P$3 -7.85,-1.9; P$4 7.85,-1.9
2X20 = drill 1.016 octagon: 1 -24.13,-1.27; 2 -24.13,1.27; 3 -21.59,-1.27; 4 -21.59,1.27; 5 -19.05,-1.27; 6 -19.05,1.27; 7 -16.51,-1.27; 8 -16.51,1.27; 9 -13.97,-1.27; 10 -13.97,1.27; 11 -11.43,-1.27; 12 -11.43,1.27; 13 -8.89,-1.27; 14 -8.89,1.27; 15 -6.35,-1.27; 16 -6.35,1.27; 17 -3.81,-1.27; 18 -3.81,1.27; 19 -1.27,-1.27; 20 -1.27,1.27; 21 1.27,-1.27; 22 1.27,1.27; 23 3.81,-1.27; 24 3.81,1.27; 25 6.35,-1.27; 26 6.35,1.27; 27 8.89,-1.27; 28 8.89,1.27; 29 11.43,-1.27; 30 11.43,1.27; 31 13.97,-1.27; 32 13.97,1.27; 33 16.51,-1.27; 34 16.51,1.27; 35 19.05,-1.27; 36 19.05,1.27; 37 21.59,-1.27; 38 21.59,1.27; 39 24.13,-1.27; 40 24.13,1.27
2X10 = drill 1.016 octagon: 1 -11.43,-1.27; 2 -11.43,1.27; 3 -8.89,-1.27; 4 -8.89,1.27; 5 -6.35,-1.27; 6 -6.35,1.27; 7 -3.81,-1.27; 8 -3.81,1.27; 9 -1.27,-1.27; 10 -1.27,1.27; 11 1.27,-1.27; 12 1.27,1.27; 13 3.81,-1.27; 14 3.81,1.27; 15 6.35,-1.27; 16 6.35,1.27; 17 8.89,-1.27; 18 8.89,1.27; 19 11.43,-1.27; 20 11.43,1.27
USB-MICRO = smd 0.35 x 1.4: D+ 0,2.65; D- -0.65,2.65; GND 1.3,2.65; ID 0.65,2.65; VBUS -1.3,2.65 | smd 1.8 x 1.9: MT1 -4,0; MT2 4,0 | smd 1.9 x 1.9: P$1 -1.27,0; P$2 1.27,0
BOURNS-SRN4018 = smd 1.5 x 3.5: P$1 -1.525,0; P$2 1.525,0
CHIP-LED0603 = smd 0.8 x 0.8: A 0,-0.75; C 0,0.75
RPI_COMPUTE = smd 0.35 x 2: 1 -31.38,-4.1; 2 -31.08,4.1; 3 -30.78,-4.1; 4 -30.48,4.1; 5 -30.18,-4.1; 6 -29.88,4.1; 7 -29.58,-4.1; 8 -29.28,4.1; 9 -28.98,-4.1; 10 -28.68,4.1; 11 -28.38,-4.1; 12 -28.08,4.1; 13 -27.78,-4.1; 14 -27.48,4.1; 15 -27.18,-4.1; 16 -26.88,4.1; 17 -26.58,-4.1; 18 -26.28,4.1; 19 -25.98,-4.1; 20 -25.68,4.1; 21 -25.38,-4.1; 22 -25.08,4.1; 23 -24.78,-4.1; 24 -24.48,4.1; 25 -24.18,-4.1; 26 -23.88,4.1; 27 -23.58,-4.1; 28 -23.28,4.1; 29 -22.98,-4.1; 30 -22.68,4.1; 31 -22.38,-4.1; 32 -22.08,4.1; 33 -21.78,-4.1; 34 -21.48,4.1; 35 -21.18,-4.1; 36 -20.88,4.1; 37 -20.58,-4.1; 38 -20.28,4.1; 39 -19.98,-4.1; 40 -19.68,4.1; 41 -15.78,-4.1; 42 -15.48,4.1; 43 -15.18,-4.1; 44 -14.88,4.1; 45 -14.58,-4.1; 46 -14.28,4.1; 47 -13.98,-4.1; 48 -13.68,4.1; 49 -13.38,-4.1; 50 -13.08,4.1; 51 -12.78,-4.1; 52 -12.48,4.1; 53 -12.18,-4.1; 54 -11.88,4.1; 55 -11.58,-4.1; 56 -11.28,4.1; 57 -10.98,-4.1; 58 -10.68,4.1; 59 -10.38,-4.1; 60 -10.08,4.1; 61 -9.78,-4.1; 62 -9.48,4.1; 63 -9.18,-4.1; 64 -8.88,4.1; 65 -8.58,-4.1; 66 -8.28,4.1; 67 -7.98,-4.1; 68 -7.68,4.1; 69 -7.38,-4.1; 70 -7.08,4.1; 71 -6.78,-4.1; 72 -6.48,4.1; 73 -6.18,-4.1; 74 -5.88,4.1; 75 -5.58,-4.1; 76 -5.28,4.1; 77 -4.98,-4.1; 78 -4.68,4.1; 79 -4.38,-4.1; 80 -4.08,4.1; 81 -3.78,-4.1; 82 -3.48,4.1; 83 -3.18,-4.1; 84 -2.88,4.1; 85 -2.58,-4.1; 86 -2.28,4.1; 87 -1.98,-4.1; 88 -1.68,4.1; 89 -1.38,-4.1; 90 -1.08,4.1; 91 -0.78,-4.1; 92 -0.48,4.1; 93 -0.18,-4.1; 94 0.12,4.1; 95 0.42,-4.1; 96 0.72,4.1; 97 1.02,-4.1; 98 1.32,4.1; 99 1.62,-4.1; 100 1.92,4.1; 101 2.22,-4.1; 102 2.52,4.1; 103 2.82,-4.1; 104 3.12,4.1; 105 3.42,-4.1; 106 3.72,4.1; 107 4.02,-4.1; 108 4.32,4.1; 109 4.62,-4.1; 110 4.92,4.1; 111 5.22,-4.1; 112 5.52,4.1; 113 5.82,-4.1; 114 6.12,4.1; 115 6.42,-4.1; 116 6.72,4.1; 117 7.02,-4.1; 118 7.32,4.1; 119 7.62,-4.1; 120 7.92,4.1; 121 8.22,-4.1; 122 8.52,4.1; 123 8.82,-4.1; 124 9.12,4.1; 125 9.42,-4.1; 126 9.72,4.1; 127 10.02,-4.1; 128 10.32,4.1; 129 10.62,-4.1; 130 10.92,4.1; 131 11.22,-4.1; 132 11.52,4.1; 133 11.82,-4.1; 134 12.12,4.1; 135 12.42,-4.1; 136 12.72,4.1; 137 13.02,-4.1; 138 13.32,4.1; 139 13.62,-4.1; 140 13.92,4.1; 141 14.22,-4.1; 142 14.52,4.1; 143 14.82,-4.1; 144 15.12,4.1; 145 15.42,-4.1; 146 15.72,4.1; 147 16.02,-4.1; 148 16.32,4.1; 149 16.62,-4.1; 150 16.92,4.1; 151 17.22,-4.1; 152 17.52,4.1; 153 17.82,-4.1; 154 18.12,4.1; 155 18.42,-4.1; 156 18.72,4.1; 157 19.02,-4.1; 158 19.32,4.1; 159 19.62,-4.1; 160 19.92,4.1; 161 20.22,-4.1; 162 20.52,4.1; 163 20.82,-4.1; 164 21.12,4.1; 165 21.42,-4.1; 166 21.72,4.1; 167 22.02,-4.1; 168 22.32,4.1; 169 22.62,-4.1; 170 22.92,4.1; 171 23.22,-4.1; 172 23.52,4.1; 173 23.82,-4.1; 174 24.12,4.1; 175 24.42,-4.1; 176 24.72,4.1; 177 25.02,-4.1; 178 25.32,4.1; 179 25.62,-4.1; 180 25.92,4.1; 181 26.22,-4.1; 182 26.52,4.1; 183 26.82,-4.1; 184 27.12,4.1; 185 27.42,-4.1; 186 27.72,4.1; 187 28.02,-4.1; 188 28.32,4.1; 189 28.62,-4.1; 190 28.92,4.1; 191 29.22,-4.1; 192 29.52,4.1; 193 29.82,-4.1; 194 30.12,4.1; 195 30.42,-4.1; 196 30.72,4.1; 197 31.02,-4.1; 198 31.32,4.1; 199 31.62,-4.1; 200 31.92,4.1 | smd 4.5 x 4.6: M1 -32.28,12; M2 32.82,12 | hole 1.6: -33.13,0 | hole 1.1: 33.67,0
SOT523 = smd 1.118 x 0.457: 1 -0.965,0.66; 2 -0.965,-0.66; 3 0.965,0
R0402 = smd 0.7 x 0.9: 1 -0.65,0; 2 0.65,0
R0805 = smd 1.3 x 1.5: 1 -0.95,0; 2 0.95,0
RPI_CAMERA = smd 0.61 x 2.007: 1 6.985,2.743; 2 5.994,2.743; 3 5.004,2.743; 4 3.988,2.743; 5 2.997,2.743; 6 1.981,2.743; 7 0.991,2.743; 8 0,2.743; 9 -1.016,2.743; 10 -2.007,2.743; 11 -2.997,2.743; 12 -4.013,2.743; 13 -5.004,2.743; 14 -6.02,2.743; 15 -7.01,2.743 | smd 0.711 x 4.191: 17 -8.001,4.877; 18 7.976,4.877
MOLEX_1040310811 = smd 0.85 x 1.1: 1 3.075,-5.46; 2 1.975,-5.465; 3 0.88,-5.465; 4 -0.225,-5.46; 5 -1.33,-5.465; 6 -2.425,-5.46; 7 -3.52,-5.46 | smd 0.75 x 1.1: 8 -4.575,-5.46 | smd 1.2 x 1: 9 5.71,4.39; 10 5.71,0.685 | smd 1.55 x 1.35: 11 5.535,-5.34 | smd 1.17 x 1.8: 12 -5.785,-5.11 | smd 1.9 x 1.35: 13 2.21,5.365; 14 -3.76,5.365
WDFN3X3-12L = smd 0.25 x 1: 1 -1.125,-1.7; 2 -0.675,-1.7; 3 -0.225,-1.7; 4 0.225,-1.7; 5 0.675,-1.7; 6 1.125,-1.7; 7 1.125,1.7; 8 0.675,1.7; 9 0.225,1.7; 10 -0.225,1.7; 11 -0.675,1.7; 12 -1.125,1.7 | smd 2.5 x 1.7: PAD 0,0

### Placement (x,y rotation side)
C1  49.28,14.33 0 top
C2  44.76,6.1 180 top
C3  45.22,12.3 0 top
C4  40.11,8.17 90 top
C5  50.68,9.51 270 top
C6  44.76,4.07 180 top
C7  45.22,14.33 0 top
C8  49,30.9 180 top
C11  54.3,7 0 top
C12  62.34,46.56 90 top
C13  65.05,46.56 90 top
C14  67.76,46.56 90 top
D2  59.9,26.9 180 top
D3  63.3,26.9 180 top
D4  56.5,26.9 180 top
D5  49.6,26.9 180 top
D6  53,26.9 180 top
H1  65,52.5 180 top
H2  7,52.5 180 top
H3  7,3.5 180 top
H4  65,3.5 180 top
HDMI  66.5,16.3 90 top
JP1  36,52.5 0 top
JP2  23.34,3.5 180 bottom
JP3  1.5,13.3 90 bottom
JP6  55.99,1.5 0 bottom
L1  50.3,5.44 90 top
L2  40.14,12.81 270 top
LED1  55.56,46.95 90 top
LED2  55.56,48.14 90 top
LOGO1  [OHMYDIGIFAB_LOGO]  32,24.9 0 top
PCB1  35.68,40 180 bottom
Q4  56.5,23 90 top
R1  49.28,12.81 180 top
R2  41.38,8.17 90 top
R3  49.41,9.51 270 top
R4  51.95,9.51 90 top
R5  38.84,8.17 270 top
R6  58.48,46.95 180 top
R7  67.28,40.11 270 top
R8  64.71,40.11 270 top
R9  62.14,40.11 270 top
R10  54.7,23.95 90 top
R11  33.36,31.16 270 top
R12  31.63,31.16 270 top
R13  9.81,12.29 0 top
R14  9.81,10.64 0 top
R15  58.48,48.14 180 top
R16  9.81,32.62 0 top
R17  9.81,34.19 0 top
R18  60.6,30.9 0 top
R19  63.9,30.9 0 top
R20  54.3,5.7 0 top
U1  8.25,16.99 90 top
U2  8.36,38.9 90 top
U3  52.31,47.85 0 top
U4  44.3,7.2 0 bottom
U5  45.22,9.51 270 top

### Tracks (layer width: path | path; a pad name or v marks a point on that pad's centre or on a via)
5V_HDMI  (via drill 0.3)
  Top 0.152: D3.2 62.35,28.55 61.7,29.2 58.9,29.2 | 58.9,29.2 55.6,29.2 | 55.6,29.2 52.5,29.2 52.05,28.85 D6.2 52.05,27.05 50.8,25.8 D5.3 49.65,25.85 C8.1 | D2.2 58.95,29.15 arc90 58.9,29.2 | D4.2 55.55,29.15 arc-90 55.6,29.2 | HDMI.18 60.85,12.55
  Top 0.406: 60.85,12.55 54.95,12.55 v52.5,15 | v51.2,23.5 51.2,24.2 D5.3
  Bottom 0.406: v52.5,15 52.6,22.1 v51.2,23.5
+1V8  (via drill 0.3)
  Top 0.2: C7.1 | R10.2 54.7,25.4 v54.6,25.5
  Top 0.406: C5.1 R3.1 v49.41,10.89 v49.4,10.9 | C7.1 arc90 C7.1 L2.P$1 40.14,15.54 40.2,15.6 v40.1,15.6 | R9.2 62.14,37.93 v62.11,38
  Route2 1.016: v40.1,15.6 40.1,15.8 40.8,16.5 43.9,16.5 | 43.9,16.5 v49.4,10.9 | v54.6,25.5 54.03,25.5 54.02,25.51 51.85,25.51 | 43.9,16.5 43.97,16.57 43.97,17.63 51.85,25.51 | 51.85,25.51 51.85,29.52 51.79,29.58 51.79,34.09 53.6,35.9 60.73,35.9 62.11,37.28 v62.11,38
+3V3  (via drill 0.3)
  Top 0.2: R17.2 11.79,34.19 v11.8,34.2 | R16.2 11.78,32.62 v11.8,32.6 | 60,46 v59.9,46.1 59.13,46.87 R6.1 R15.1
  Top 0.305: R12.2 31.63,29.83 v31.6,29.8 | R11.2 33.36,29.84 v33.4,29.8
  Top 0.406: v3.8,31.9 3.81,31.89 U2.15 | R13.2 11.2,12.29 v11.2,12.3 | R14.2 11.2,10.64 v11.2,10.6 | U1.15 7.1,9.98 v7.1,9.9 | C4.1 v40.1,6.7 | R2.1 41.4,7.52 v41.4,6.7 | R8.2 64.71,38.81 v63.9,38 | L1.P$1 50.14,4.07 C6.1 45.71,3.71 v44.6,2.6
  Top 1.016: L1.P$1 50.3,4.32 v50.3,5.4
  Bottom 0.2: PCB1.4 5.2,34.7 5.5,34.4 5.8,34.7 PCB1.6
  Bottom 0.305: PCB1.39 15.7,44.7 v16.6,45.6 | PCB1.41 19.9,44.7 v19,45.6 | U4.4 44.52,2.42 44.6,2.5 v44.6,2.6 | PCB1.40 16,35.3 v16.8,34.5 | PCB1.42 20.2,35.3 v19.4,34.5
  Bottom 0.406: 5.5,34.4 5.5,33.4 4,31.9 v3.8,31.9
  pour Route2 (rank 6): 0,0 0,20.57 -0.01,25.77 0,56 72,56 72,0
+5V  (via drill 0.3)
  Top 0.152: 64.6,30.94 R19.2 64.55,30.05 arc90 v64.6,29.9 | R18.2 61.65,30.95 v61.64,29.92
  Top 0.2: U5.6 42.74,7.61 v42.9,7.6 | C2.1 45.9,6.2 | 43.5,10.65 43.5,10.63 U5.1 43.5,10.65 | 44.37,12.2 C3.1 | R1.1 | 43.5,10.65 43.45,10.65 v42.9,11.2
  Top 0.254: U5.7 46.92,7.82 v46.7,7.6
  Top 0.406: v42.9,11.2 43.9,12.2 44.37,12.2 | R1.1 v50.8,12.8 | D5.1 50.55,29.25 v53.6,32.3 | 45.9,6.2 45.9,6.8 v46.7,7.6 | R7.2 67.28,39.12 v68.5,37.9
  Route2 1.016: 56.03,7.6 v46.7,7.6 v42.9,7.6 v42.9,11.2 | v53.6,32.3 54.1,32.8 58.76,32.8 v61.64,29.92 64.58,29.92 v64.6,29.9 70.7,29.9 | v50.8,12.8 50.83,12.8 56.03,7.6 | 56.03,7.6 58.1,7.6
  other vias: 59.1,4.6 58.1,4.6 59.1,3.8 58.1,3.8
  pour Route2: 62.2,55.5 10.7,55.5 10.7,52.2 58,52.2 58,47.2 67.8,47.2 67.8,37.3 71.5,37.3 71.5,49.5 62.2,49.5
  pour Route2: 57.5,3.7 10.7,3.7 10.7,0.5 62,0.5 62,6.5 71.4,6.5 71.5,38.7 67.8,38.7 67.8,11.5 57.5,11.6
  pour Bottom: 59.5,5 57.2,5 57.2,3.4 59.5,3.4
  pour Bottom: 5.4,12.2 2.8,12.2 2.8,6.7 9.9,6.7 9.9,0.6 15.8,0.6 15.8,3.5 11.2,3.5 11.2,8.2 5.4,8.2
CAM0_C_N  (via drill 0.3)
  Top 0.254: U1.8 6.76,16.99 7,16.75 36.9,16.75 37.48,16.28 v37.5,16.31
  Bottom 0.254: v37.5,16.31 37.38,16.18 36.95,16.6 36.95,29.8 38.3,31.15 49.8,31.15 50.75,32.1 50.75,35.86 PCB1.144
CAM0_C_P  (via drill 0.3)
  Top 0.254: U1.9 6.73,15.98 7,16.25 36.4,16.25 36.92,15.72 v36.89,15.7
  Bottom 0.254: v36.89,15.7 37.02,15.82 36.45,16.4 36.45,30 38.1,31.65 49.6,31.65 50.25,32.3 50.25,35.85 PCB1.142
CAM0_D0_N  (via drill 0.3)
  Top 0.254: U1.2 6.87,22.99 7.1,22.75 35.5,22.75 35.52,22.84 v35.54,22.88
  Bottom 0.254: v35.54,22.88 35.42,22.74 35.35,22.8 35.35,30.8 37.2,32.65 48.1,32.65 48.95,33.5 48.95,35.86 PCB1.138
CAM0_D0_P  (via drill 0.3)
  Top 0.254: U1.3 6.85,22 7.1,22.25 34.9,22.25 34.86,22.18 v34.91,22.05
  Bottom 0.254: v34.91,22.05 35.06,22.28 34.85,22.5 34.85,31 37,33.15 47.9,33.15 48.45,33.7 48.45,35.85 PCB1.136
CAM0_D1_N  (via drill 0.3)
  Top 0.254: U1.5 6.76,19.99 7,19.75 39.2,19.75 38.98,19.78 v39.2,19.92
  Bottom 0.254: v39.2,19.92 38.88,19.78 38.45,20.2 38.45,28.7 39.4,29.65 50.7,29.65 52.55,31.5 52.55,35.86 PCB1.150
CAM0_D1_P  (via drill 0.3)
  Top 0.254: U1.6 6.73,18.97 7,19.25 38.5,19.25 38.62,19.22 v38.54,19.05
  Bottom 0.254: v38.54,19.05 38.62,19.32 37.95,20 37.95,28.9 39.2,30.15 50.5,30.15 52.05,31.7 52.05,35.85 PCB1.148
CAM0_IO0  (via drill 0.3)
  Top 0.2: 5.61,14 7.6,14 8.4,14.8 v13.5,14.8
  Top 0.254: U1.11 5.61,14
  Bottom 0.2: PCB1.36 14.8,16.1 v13.5,14.8
CAM0_IO1  (via drill 0.3)
  Top 0.2: 5.62,13 7.8,13 8.9,14.1 v11.6,14.1
  Top 0.254: U1.12 5.62,13
  Bottom 0.2: v11.6,14.1 14.2,16.7 PCB1.34
CAM0_SCL  (via drill 0.3)
  Top 0.152: R13.1 9.16,12
  Top 0.2: U1.13 9.16,11.99 9.16,12 v8.4,12
  Bottom 0.2: v8.4,12 8.4,13.9 13,18.5 PCB1.30
CAM0_SDA  (via drill 0.3)
  Top 0.152: R14.1 9.19,10.67 9.19,10.94 9.16,10.97
  Top 0.2: U1.14 v7.69,10.97 9.16,10.97
  Bottom 0.2: v7.69,10.97 7.7,11.26 7.7,14.2 12.4,18.9 PCB1.28
CAM1_C_N  (via drill 0.3)
  Top 0.254: v53.5,40 53.38,39.88 53.1,40.15 41,40.15 38.8,37.95 9.6,37.95 9,38.55 7.5,38.55 7.15,38.9 U2.8
  Bottom 0.254: PCB1.149 52.3,40.96 53.38,39.88 v53.5,40
CAM1_C_P  (via drill 0.3)
  Top 0.254: v52.9,39.4 53.02,39.52 52.9,39.65 41.2,39.65 39,37.45 9.4,37.45 8.8,38.05 7.5,38.05 7.33,37.88 U2.9
  Bottom 0.254: PCB1.147 51.7,40.85 53.02,39.52 v52.9,39.4
CAM1_D0_N  (via drill 0.3)
  Top 0.254: v56.2,42.4 56.08,42.28 55.6,42.75 39.8,42.75 37.7,40.65 11.1,40.65 8.85,42.9 8.85,43.7 8,44.55 7.1,44.55 6.76,44.89 U2.2
  Bottom 0.254: PCB1.161 55.9,42.46 56.08,42.28 v56.2,42.4
CAM1_D0_P  (via drill 0.3)
  Top 0.254: v55.6,41.8 55.72,41.92 55.4,42.25 40,42.25 37.9,40.15 10.9,40.15 8.35,42.7 8.35,43.5 7.8,44.05 7.1,44.05 6.96,43.9 U2.3
  Bottom 0.254: PCB1.159 55.3,42.35 55.72,41.92 v55.6,41.8
CAM1_D1_N  (via drill 0.3)
  Top 0.254: v54.9,41.3 54.78,41.18 54.5,41.45 40.3,41.45 38.2,39.35 10.4,39.35 8.1,41.65 7.7,41.65 7.46,41.9 U2.5
  Bottom 0.254: PCB1.155 54.1,41.86 54.78,41.18 v54.9,41.3
CAM1_D1_P  (via drill 0.3)
  Top 0.254: v54.3,40.7 54.42,40.82 54.3,40.95 40.5,40.95 38.4,38.85 10.2,38.85 7.9,41.15 7.7,41.15 7.43,40.88 U2.6
  Bottom 0.254: PCB1.153 53.5,41.75 54.42,40.82 v54.3,40.7
CAM1_IO0  (via drill 0.3)
  Top 0.2: v22,34.3 22,35.4 21.5,35.9 U2.11
  Bottom 0.2: v22,34.3 PCB1.48
CAM1_IO1  (via drill 0.3)
  Top 0.2: U2.12 7.69,34.89 8,35.2 20.9,35.2 21.4,34.7 v21.4,33.7
  Bottom 0.2: 21.3,35.81 PCB1.46 v21.4,33.7
CAM1_SCL  (via drill 0.3)
  Top 0.2: v1.5,41.5 1.1,41.1 1.1,34.4 1.6,33.9 U2.13 9.16,33.9 R17.1 | v6.5,48 12.6,41.9 35.5,41.9 38,44.4 38,46.9 39.5,48.4 42.3,48.4 43.6,49.7 43.6,52.2 43.9,52.5 44.6,52.5 44.89,52.79 JP1.28
  Bottom 0.2: v1.5,41.5 5,41.5 5.5,42 PCB1.5 5.5,47 v6.5,48
CAM1_SDA  (via drill 0.3)
  Top 0.2: v1.1,42.3 0.7,41.9 0.7,33.4 1.22,32.88 U2.14 9.16,32.88 R16.1 | JP1.27 44.89,50.09 42.7,47.9 39.8,47.9 38.5,46.6 38.5,44.1 35.8,41.4 12.3,41.4 5.6,48.1 v5.2,48.1
  Bottom 0.2: v1.1,42.3 4.3,42.3 4.9,42.9 PCB1.3 4.9,47.8 v5.2,48.1
CM_1V8  (via drill 0.3 pad 0.3)
  Top 0.61: C12.1 62.35,43.05 v63,42.4 62.14,41.54 R9.1
  Bottom 0.2: PCB1.184 PCB1.186 | PCB1.183 PCB1.185
  pour Bottom: 63.6,45 62.4,45 62.4,35 63.6,35
CM_3V3  (via drill 0.3 pad 0.3)
  Top 0.61: C13.1 65.05,42.47 v65,42.4 64.71,42.11 R8.1
  Bottom 0.2: PCB1.190 PCB1.192 PCB1.194 | PCB1.193 PCB1.191 PCB1.189
  pour Bottom: 66,45 64.2,45 64.2,35 66,35
CM_VBAT  (via drill 0.3 pad 0.3)
  Top 0.61: C14.1 67.77,42.97 v67.2,42.4 67.28,42.32 R7.1
  Bottom 0.2: PCB1.200 PCB1.198 | PCB1.197 PCB1.199
  pour Bottom: 67.8,45 67.8,35 66.6,35 66.6,45
GND  (via drill 0.3)
  Top 0.2: U5.3 45.22,9.73 U5.PAD 45.22,9.28 U5.9 | U5.3 41.7,9.72 v39.2,9.8
  Bottom 0.152: 53.2,37.3 53.5,37.3 | PCB1.187 63.7,45.7 63.8,45.8 66.1,45.8
  Bottom 0.2: PCB1.169 58.3,45.7 58.2,45.8 56.5,45.8 | 56.5,45.8 PCB1.163 56.5,45.8 | 56.5,45.8 54.7,45.8 | 54.7,45.8 54.7,45.6 PCB1.157 54.7,45.8 | 54.7,45.8 52.9,45.8 | 52.9,45.8 52.9,45.4 PCB1.151 52.9,45.8 | 52.9,45.8 51.1,45.8 51.1,45.7 PCB1.145 51.1,44.21 51.1,44.9 | 51.4,37.3 53.2,37.3 53.2,37.1 PCB1.152 | PCB1.146 51.4,37.3 | 51.4,37.3 49.6,37.3 | 49.6,37.3 49.6,37 PCB1.140 49.6,37.3 | 49.6,37.3 47.8,37.3 47.8,37.1 | 47.8,37.1 PCB1.134 47.8,37.1 | 66.1,45.8 PCB1.195 | PCB1.187 63.7,45.8 | PCB1.187 | PCB1.187 | 66.4,34 PCB1.196 | 64,34.1 PCB1.188 | 62.2,34 PCB1.182
  other vias: 33.9,9.7 52.63,12.64 33.8,14.9 48.1,38 37.5,13.3 7.4,15 40.8,18.5 7.6,18 49.4,15.5 7.9,21 64.7,12.6 67.9,5.7 67.4,1 70.3,1.9 68.8,3.5 70.8,5.1 69,17.2 33.7,12.1 34.1,7.1 41.3,4 54.01,14.91 11.5,21 17.11,18.01 36.5,4 44.8,45.66 21.8,48.7 20.1,47.1 41.2,45.67 20.2,45.8 47.7,15.5 22.2,18 35.5,18 22.1,6.4 23.5,10.1 18.3,6 22.3,11.3 17.6,11.1 20.1,15 17,15 19.5,13 1.3,5.2 2.4,1.5 1.5,7.5 4.1,1.2 13.3,10 3.3,5.2 13.2,6.3 15.4,8.6 15.2,12.6 3.4,16.3 3.3,19.2 1,19.3 3.5,23.6 6.3,28.9 1.1,23.7 2.7,32 0.9,31.9 3.9,35.2 3.4,36.3 1,43.4 3,37.6 2,36.4 3.8,45.7 1.1,45.6 3.1,43.2 6.9,48.9 3.9,48.1 1.1,48.1 1.1,50.9 4.1,54.8 3.4,49.8 10,47.3 11.2,47.8 13.8,47.5 12.4,48.4 17.5,47.1 15.4,46.1 2.5,34.8 15.8,32.9 18.9,30.7 3.7,38.3 22.1,32.6 22.3,28.4 15.7,28.5 43.9,34.2 34.8,32.8 22.3,21 34.9,34.2 40,34.2 45.7,34.2 42,34.2 35.4,20.8 33.7,21 17.1,21 8.2,24.4 35.6,14.9 36.8,10.8 36.6,8.1 33.8,18 40.3,23 42.7,17.6 38.8,4 38.5,17.6 55.4,13.4 61.4,22.1 65.5,28.6 64.4,21.8 45.7,27.4 55.7,23.2 56.1,15.1 15.8,5.8 42.5,22.7 47.5,18.6 69,22.2 65.4,25.4 68.9,12.5 64.6,17.2 65.7,34.3 58.7,26 52.8,30 61.3,34.2 68.9,31.3 53.7,34.1 61.5,26.2 53.6,24.5 55.6,31.1 56.1,34 67.3,34.3 66.5,31.3 48.4,26.5 69.2,36.3 69.1,41.6 69.2,46.4 69.1,43.8 55.4,37.8 60.9,42.4 55.8,39.3 61.1,37.7 70.9,50.5 67.5,54.9 70.4,53.4 69,51.5 48.7,50.7 46.2,50.7 1.8,53.8 52,37.9 45.7,38.6 43.8,38.6 42,38.6 24.2,47.6 53.79,53.23 9.6,54.9 10.5,52 10.1,50.7
  pour Top (rank 6): 0,0 0,20.57 -0.01,25.77 0,56 72,56 72,0
  pour Bottom (rank 6): 71.99,0 71.99,56 -0.01,56 -0.01,25.77 0,20.57 0,0
  pour Route15 (rank 6): 0,0 0,20.57 -0.01,25.77 0,56 72,56 72,0
GPIO2
  Bottom 0.2: PCB1.9 6.7,47.1 9.5,49.9 13.1,49.9 14.41,51.21 JP1.3
GPIO3
  Bottom 0.2: PCB1.11 7.3,46.9 9.9,49.5 15.4,49.5 16.95,51.05 JP1.5
GPIO4
  Bottom 0.2: PCB1.15 8.5,46.9 10.7,49.1 18.2,49.1 19.49,50.39 JP1.7
GPIO5  (via drill 0.3)
  Top 0.2: JP1.29 v47.43,49.33 | v9.1,46.5 9.1,46.2 13,42.4 35.2,42.4 37.4,44.6 37.4,47.1 39.3,49 41.8,49 v42.1,49.3
  Bottom 0.2: v9.1,46.5 9.1,45.8 PCB1.17 | v47.43,49.33 v47.43,49.34 47.23,49.54 42.33,49.53 v42.1,49.3
GPIO6  (via drill 0.3)
  Top 0.2: v10.3,46.5 10.3,45.8 13.2,42.9 34.9,42.9 36.8,44.8 36.8,47.3 39,49.5 41,49.5 v41.5,50 | JP1.31 50,51.23 v50,50
  Bottom 0.2: v10.3,46.5 PCB1.21 | v50,50 v41.5,50
GPIO7  (via drill 0.3)
  Top 0.2: v11.2,46.5 11.2,45.7 13.4,43.5 34.7,43.5 36.2,45 36.2,47.4 38.9,50.1 40.6,50.1 41.1,50.6 41.1,52.2 41.4,52.5 42.1,52.5 42.35,52.75 JP1.26
  Bottom 0.2: v11.2,46.5 10.9,46.2 PCB1.23
GPIO8  (via drill 0.3)
  Top 0.2: v12.1,46.5 12.1,45.6 13.7,44 34.4,44 35.6,45.2 35.6,47.7 38.5,50.6 38.5,52.2 38.8,52.5 39.5,52.5 39.77,52.77 39.77,53.77 JP1.24
  Bottom 0.2: v12.1,46.5 12.1,45.8 PCB1.27
GPIO9
  Bottom 0.2: PCB1.29 12.7,47.7 13.4,48.4 19.4,48.4 21,50 36.9,50 37.27,50.37 JP1.21
GPIO10  (via drill 0.3)
  Top 0.2: JP1.19 34.9,51.06 34.9,45.3 34.2,44.6 14.3,44.6 13.9,45 v13.9,46.5
  Bottom 0.2: v13.9,46.5 13.9,45.7 PCB1.33
GPIO11
  Bottom 0.2: PCB1.35 14.5,47.2 15.2,47.9 19.6,47.9 21.3,49.6 39.2,49.6 39.8,50.2 JP1.23
GPIO12  (via drill 0.3)
  Top 0.2: JP1.32 50,53.74 50,52.8 50.3,52.5 51,52.5 51.2,52.3 v51.2,50.04
  Bottom 0.2: PCB1.45 21.1,46.9 22.9,48.7 50.4,48.7 51.2,49.5 v51.2,50.04
GPIO13
  Bottom 0.2: PCB1.47 21.7,46.6 23.4,48.3 51.88,48.3 52.51,48.93 JP1.33
GPIO14  (via drill 0.3)
  Top 0.2: JP1.8 20.76,52.5 22.3,52.5 23.1,51.7 23.1,46.7 v22.8,46.4
  Bottom 0.2: v22.8,46.4 22.9,46.3 PCB1.51
GPIO15  (via drill 0.3)
  Top 0.2: v23.5,45.9 23.5,52.3 23,52.8 23,53.6 22.83,53.77 JP1.10
  Bottom 0.2: v23.5,45.9 23.5,45.5 PCB1.53
GPIO16  (via drill 0.3)
  Top 0.2: JP1.36 55,53.72 55,52.8 54.7,52.5 54.2,52.5 53.8,52.1 v53.8,49.72
  Bottom 0.2: v53.8,49.72 53.8,48.6 53.1,47.9 25.4,47.9 24.7,47.2 PCB1.57
GPIO17  (via drill 0.3)
  Top 0.2: JP1.11 25.3,50.5 v25.3,45.9
  Bottom 0.2: v25.3,45.9 25.3,45.8 PCB1.59
GPIO18  (via drill 0.3)
  Top 0.2: v26.4,45.9 26.3,45.9 26,46.2 26,52 25.5,52.5 24.9,52.5 24.57,52.83 JP1.12
  Bottom 0.2: v26.4,45.9 26.5,45.8 PCB1.63
GPIO19
  Bottom 0.2: PCB1.65 27.1,46.8 27.8,47.5 54.6,47.5 55.05,47.95 JP1.35
GPIO20  (via drill 0.3)
  Top 0.2: v55.9,49.4 56.1,49.4 56.1,52.3 56.5,52.7 57.3,52.7 57.59,52.99 JP1.38
  Bottom 0.2: PCB1.69 28.3,46.3 29.1,47.1 55.7,47.1 56.1,47.5 56.1,49.4 v55.9,49.4
GPIO21  (via drill 0.3)
  Top 0.2: JP1.40 60.1,53.74 60.1,52.6 59.8,52.3 57,52.3 56.5,51.8 56.5,49.4 v56.7,49.4
  Bottom 0.2: PCB1.71 28.9,46.2 29.4,46.7 55.9,46.7 56.5,47.3 56.5,49.4 v56.7,49.4
GPIO22  (via drill 0.3)
  Top 0.2: JP1.15 29.65,46.15 v29.8,46
  Bottom 0.2: PCB1.75 30.1,45.7 v29.8,46
GPIO23  (via drill 0.3)
  Top 0.2: v30.7,46 30.7,52.2 30.4,52.5 29.9,52.5 29.65,52.75 JP1.16
  Bottom 0.2: v30.7,46 30.7,45.9 PCB1.77
GPIO24  (via drill 0.3)
  Top 0.2: v31.6,46 31.1,46.5 31.1,52.2 31.4,52.5 31.9,52.5 32.17,52.77 32.17,53.77 JP1.18
  Bottom 0.2: v31.6,46 31.9,45.7 PCB1.81
GPIO25  (via drill 0.3)
  Top 0.2: v32.5,46 33.5,47 33.5,51.8 34.2,52.5 36.9,52.5 37.27,52.87 JP1.22
  Bottom 0.2: 32.5,43.2 PCB1.83 v32.5,46
GPIO26
  Bottom 0.2: JP1.37 57.6,47.1 56.8,46.3 34,46.3 33.7,46 PCB1.87
GPIO27  (via drill 0.3)
  Top 0.2: v34.3,45.7 34,45.4 28.2,45.4 27.11,46.49 JP1.13
  Bottom 0.2: PCB1.89 v34.3,45.7
GPIO34
  Bottom 0.2: JP2.7 19.5,4.8 19.5,7.5 23.2,11.2 PCB1.52
GPIO35
  Bottom 0.2: JP2.11 24.6,10.4 23.8,11.2 PCB1.54
GPIO36
  Bottom 0.2: JP2.12 25.9,3.52 25.9,10.8 25,11.7 PCB1.58
GPIO37
  Bottom 0.2: JP2.13 27.2,4.82 27.2,11.2 25.6,12.8 PCB1.60
GPIO38
  Bottom 0.2: PCB1.64 26.8,13.3 28.4,11.7 28.4,3.52 JP2.16
GPIO39
  Bottom 0.2: JP2.15 29.7,12 27.4,14.3 PCB1.66
GPIO40  (via drill 0.3)
  Top 0.2: v22.6,8.7 v30.5,8.7
  Bottom 0.2: v30.5,8.7 30.5,12.3 28.6,14.2 PCB1.70 | JP2.8 20.8,3.5 20.8,6.9 v22.6,8.7
GPIO41  (via drill 0.3)
  Top 0.2: v24,7.6 v31.2,7.6
  Bottom 0.2: v31.2,7.6 31.2,12.7 29.2,14.7 PCB1.72 | JP2.10 22.07,2.27 23.3,3.5 23.3,6.9 v24,7.6
GPIO42
  Bottom 0.2: JP2.18 31,3.46 31,5.9 32.1,7 32.1,12.9 30.4,14.6 PCB1.76
GPIO43
  Bottom 0.2: PCB1.78 31,14.8 32.7,13.1 32.7,6.84 JP2.19
GPIO44  (via drill 0.3)
  Top 0.2: v21.2,14.7 31.8,14.7 v31.9,14.8 | R12.1 31.63,32.42 v32,32.8
  Bottom 0.2: v32,32.8 32.2,32.8 | 32.2,32.8 PCB1.82 | JP2.3 14.4,4.82 14.4,6.1 21.2,12.9 v21.2,14.7 | 32.2,32.8 32.2,15.1 v31.9,14.8
GPIO45  (via drill 0.3)
  Top 0.2: v22,13.9 22.2,14.1 v32.8,14.1 | R11.1 33.35,32.44 v33,32.8
  Bottom 0.2: 32.8,32.8 PCB1.84 | JP2.5 17,6.9 22,11.9 v22,13.9 | v32.8,14.1 32.8,32.8 | 32.8,32.8 v33,32.8
GPIO46  (via drill 0.3)
  Top 0.152: v40.2,28.3 v33.9,28.3 | v52.9,23.8 53.4,23.3 R10.1 55.37,23.96 Q4.3
  Bottom 0.152: v52.9,23.8 52.2,23.8 47.7,28.3 v40.2,28.3 | v33.9,28.3 34,28.5 PCB1.88
GPIO47_1V8  (via drill 0.3)
  Top 0.2: U3.1 50.11,48.51 46.1,44.5 40.2,44.5 v37.3,41.6
  Bottom 0.2: v37.3,41.6 34.6,38.9 PCB1.90
HDMI_CEC  (via drill 0.3)
  Top 0.152: v59,24.1 57.3,25.8 D4.3 55.6,25.8 v54.7,26.7 | v59,15.1 59.05,15.05 HDMI.13 | v58.9,41 58.9,30.7 58.3,30.1 54.9,30.1 v54.7,29.9
  Bottom 0.152: v59,24.1 v59,15.1 | PCB1.171 v58.9,41 | v54.7,26.7 v54.7,29.9
HDMI_CK_N  (via drill 0.3)
  Top 0.152: HDMI.12 60.6,15.55 60.3,15.85 51.44,15.85 40.95,26.34 40.95,37.7 v40.72,37.7
  Bottom 0.152: v40.72,37.7 40.95,37.7 40.95,42.4 40.9,42.45 PCB1.111
HDMI_CK_P  (via drill 0.3)
  Top 0.152: HDMI.10 60.7,16.55 60.3,16.15 51.56,16.15 41.25,26.46 41.25,37.7 v41.48,37.7
  Bottom 0.152: v41.48,37.7 41.25,37.7 41.25,42.4 41.5,42.65 PCB1.113
HDMI_D0_N  (via drill 0.3)
  Top 0.152: HDMI.9 60.5,17.05 60.2,17.35 51.94,17.35 42.85,26.44 42.85,37.7 v42.62,37.7
  Bottom 0.152: v42.62,37.7 42.85,37.7 42.85,42.5 42.7,42.65 PCB1.117
HDMI_D0_P  (via drill 0.3)
  Top 0.152: HDMI.7 60.6,18.05 60.2,17.65 52.06,17.65 43.15,26.56 43.15,37.7 v43.38,37.7
  Bottom 0.152: v43.38,37.7 43.15,37.7 43.15,42.5 43.3,42.65 PCB1.119
HDMI_D1_N  (via drill 0.3)
  Top 0.152: HDMI.6 60.5,18.55 60.2,18.85 52.44,18.85 44.55,26.74 44.55,37.7 v44.32,37.7
  Bottom 0.152: v44.32,37.7 44.55,37.7 44.55,42.5 44.5,42.55 PCB1.123
HDMI_D1_P  (via drill 0.3)
  Top 0.152: HDMI.4 60.6,19.55 60.2,19.15 52.56,19.15 44.85,26.86 44.85,37.7 v45.08,37.7
  Bottom 0.152: v45.08,37.7 44.85,37.7 44.85,42.5 45.1,42.75 PCB1.125
HDMI_D2_N  (via drill 0.3)
  Top 0.152: HDMI.3 60.5,20.05 60.2,20.35 52.74,20.35 46.45,26.64 46.45,37.7 v46.22,37.7
  Bottom 0.152: v46.22,37.7 46.45,37.7 46.45,42.5 46.3,42.65 PCB1.129
HDMI_D2_P  (via drill 0.3)
  Top 0.152: HDMI.1 60.6,21.05 60.2,20.65 52.86,20.65 46.75,26.76 46.75,37.7 v46.98,37.7
  Bottom 0.152: v46.98,37.7 46.75,37.7 46.75,42.5 46.9,42.65 PCB1.131
HDMI_SCL  (via drill 0.3)
  Top 0.152: v60.2,23.3 62.7,25.8 D3.3 63.3,30.8 R19.1 | v60.2,14.3 60.45,14.05 HDMI.15 | R19.1 63.15,30.95 | v60.1,41 60.1,34.2 60.9,33.4 60.9,32.4 61.4,31.9 63.1,31.9 63.25,31.75 R19.1
  Bottom 0.152: v60.2,23.3 v60.2,14.3 | v60.1,41 PCB1.175
HDMI_SDA  (via drill 0.3)
  Top 0.152: HDMI.16 59.85,13.55 v59.6,13.6 | v59.9,24.8 D2.3 v59.9,27 | v59.5,40.3 59.5,34.1 59.95,33.65 R18.1 59.96,29.96 v59.9,29.9
  Bottom 0.152: v59.6,13.6 59.6,24.5 v59.9,24.8 | v59.5,40.3 PCB1.173 | v59.9,27 v59.9,29.9
N$1
  Top 0.2: U5.12 48.63,10.63 R1.2 C1.1
N$2
  Top 0.2: U5.8 48,8.83 48,7 50.3,7 L1.P$2
N$7
  Top 0.2: U5.2 40.14,10.18 L2.P$2
N$8
  Top 0.2: R5.1 C4.2 R2.2 42.3,8.82 42.3,9.28 U5.4
N$9
  Top 0.203: R6.2 LED1.A
N$10
  Top 0.2: U5.10 48.5,9.73 48.5,8.8 49.41,8.8 R3.2 C5.2 R4.1
N$32
  Top 0.203: R15.2 LED2.A
N$33
  Top 0.203: LED2.C 54.52,47.85 U3.3
N$34  (via drill 0.3)
  Top 0.152: Q4.1 55.77,22.1 v53.3,22.1 52.6,22.1 51.8,22.9 51.8,25.3 52.3,25.8 D6.3 | HDMI.19 56.37,12.05 56.07,11.75 55.95,11.75 v55.81,11.74
  Bottom 0.152: v53.3,22.1 53.3,11.3 53.7,10.9 54.97,10.9 v55.81,11.74
SDX_CLK  (via drill 0.3)
  Top 0.152: v39.7,26.2 6.5,26.3 v6.4,26.3
  Bottom 0.152: U4.5 45.63,2.47 45.53,2.5 45.53,24.47 43.8,26.2 v39.7,26.2 | v6.4,26.3 7,26.9 PCB1.10
SDX_CMD  (via drill 0.3)
  Top 0.152: v40.3,25.6 v7.4,25.6
  Bottom 0.152: U4.3 43.42,3.12 45,4.7 45,24 43.4,25.6 v40.3,25.6 | v7.4,25.6 7.6,26 PCB1.12
SDX_D0  (via drill 0.3)
  Top 0.152: v40.3,26.9 v8.6,26.9
  Bottom 0.152: U4.7 47.82,9.48 46.1,11.2 46.1,24.8 44,26.9 v40.3,26.9 | v8.6,26.9 8.8,27.1 PCB1.16
SDX_D1  (via drill 0.3)
  Top 0.152: v39.7,27.6 v9.4,27.6
  Bottom 0.152: U4.8 48.88,9.22 46.7,11.4 46.7,25.1 44.2,27.6 v39.7,27.6 | v9.4,27.6 PCB1.18
SDX_D2  (via drill 0.3)
  Top 0.152: v40.3,24.3 v10.2,24.3
  Bottom 0.152: U4.1 41.23,2.73 43.8,5.3 43.8,22.9 42.5,24.3 v40.3,24.3 | v10.2,24.3 10.6,24.7 PCB1.22
SDX_D3  (via drill 0.3)
  Top 0.152: v39.7,25 v11.2,25
  Bottom 0.152: U4.2 42.33,2.83 44.4,4.9 44.4,23.7 43.1,25 v39.7,25 | v11.2,25 11.2,26.1 PCB1.24
USB2_SHELL  (via drill 0.3)
  other vias: 52.7,4.5 52.7,3.6 53.7,4.5 53.7,3.6
  pour Bottom: 50.8,0.5 61.7,0.5 61.7,2.9 53.9,2.8 53.9,5.1 52.5,5.1 52.5,2.9 50.8,2.9
  pour Top: 52.4,7.9 54,7.9 54,3.2 52.4,3.2
USB_D_N  (via drill 0.3)
  Top 0.254: v57.78,37.9 57.6,37.9 57.6,31.1 v57.78,31.1
  Bottom 0.254: PCB1.167 57.7,42.59 57.6,42.5 57.6,37.9 v57.78,37.9 | v57.78,31.1 57.6,31.1 57.6,11.52 56.52,10.44 56.52,7.31 56.52,5.7 56.65,5.58 JP6.D-
USB_D_P  (via drill 0.3)
  Top 0.254: v57.02,37.9 57.2,37.9 57.2,31.1 v57.02,31.1
  Bottom 0.254: PCB1.165 57.1,42.6 57.2,42.5 57.2,37.9 v57.02,37.9 | v57.02,31.1 57.2,31.1 57.2,11.68 56.12,10.6 56.12,7.31 56.12,5.7 55.99,5.58 JP6.D+

### Text on the board
tPlace: Picam360 | RPCM Board | Rev.0.10 | *
bPlace: PWR